# Altium project S7CAS-PLEIADES-CARTE-MERE_Pxx.PrjPcb (part 1 of 5)
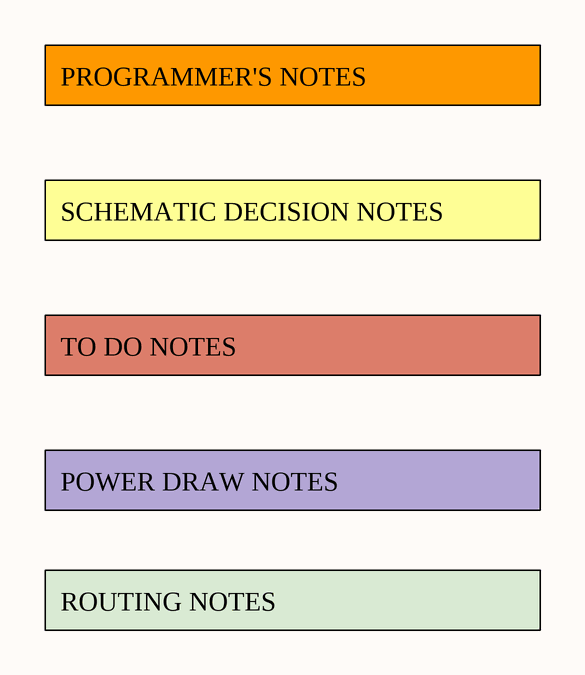
[diagram p0: S7CAS-PLEIADES-CARTE-MERE_Pxx_OVERVIEW.SchDoc]
Project_Revision: 1.00; Project_Name: PLEIADES MOTHERBOARD; Project_Group: P15; Project_Global: PLEIADES; Project_Designer2: Brahim Khalil Tekil; Project_Designer1: Julien Guay; Project_Date: 2024-01-30
18 sheets, 702 parts. Net scope: flat (ports and power ports of the same name join across sheets).
Board file: S7CAS-PLEIADES-CARTE-MERE_Pxx.PcbDoc
Sheets:
  S7CAS-PLEIADES-CARTE-MERE_Pxx_TITLE.SchDoc
  S7CAS-PLEIADES-CARTE-MERE_Pxx_OVERVIEW.SchDoc
  S7CAS-PLEIADES-CARTE-MERE_Pxx_FPGA_bank0_1_5.SchDoc
  S7CAS-PLEIADES-CARTE-MERE_Pxx_DDR.SchDoc
  S7CAS-PLEIADES-CARTE-MERE_Pxx_FPGA_bank3.SchDoc
  S7CAS-PLEIADES-CARTE-MERE_Pxx_FPGA_bank2_4.SchDoc
  S7CAS-PLEIADES-CARTE-MERE_Pxx_POWER_FPGA.SchDoc
  S7CAS-PLEIADES-CARTE-MERE_Pxx_DEBUG_USB.SchDoc
  S7CAS-PLEIADES-CARTE-MERE_Pxx_PHY.SchDoc
  S7CAS-PLEIADES-CARTE-MERE_Pxx_FLASH_PHY_CLOCK.SchDoc
  S7CAS-PLEIADES-CARTE-MERE_Pxx_CNA.SchDoc
  S7CAS-PLEIADES-CARTE-MERE_Pxx_CAN.SchDoc
  S7CAS-PLEIADES-CARTE-MERE_Pxx_MOTEUR.SchDoc
  S7CAS-PLEIADES-CARTE-MERE_Pxx_IO_SENSOR.SchDoc
  S7CAS-PLEIADES-CARTE-MERE_Pxx_ARBRE_ALIMENTATION.SchDoc
  S7CAS-PLEIADES-CARTE-MERE_Pxx_ARBRE_CAP_ARBRE.SchDoc
  S7CAS-PLEIADES-CARTE-MERE_Pxx_MECANICAL.SchDoc
  S7CAS-PLEIADES-CARTE-MERE_TO_BE_DELETED.SchDoc

## Sheet S7CAS-PLEIADES-CARTE-MERE_Pxx_TITLE.SchDoc
size Tabloid; SheetNumber: 1; SheetTotal: 3; Sheet_Name: Insert name in Document Parameters; Size: 11x17

### Notes on the sheet
- Revision history
- Package size conversion
- Metric
- 1005
- 1608
- Imperial
- 0402
- 0603
- Revision
- 2012
- 3216
- 0805
- 1206
- 3225
- 6432
- 1210
- 2512
- Date :
- Project Title
- Global Project
- Size
- Group
- Date
- Sheet
- of
- Filename
- Designers

## Sheet S7CAS-PLEIADES-CARTE-MERE_Pxx_OVERVIEW.SchDoc
size Tabloid; SheetNumber: 2; SheetTotal: 14; Sheet_Name: Insert name in Document Parameters; Size: 11x17

### Notes on the sheet
- PROGRAMMER'S NOTES
- SCHEMATIC DECISION NOTES
- TO DO NOTES
- POWER DRAW NOTES
- ROUTING NOTES
- Sheet Name
- Project Title
- Global Project
- Size
- Group
- Revision
- Date
- Sheet
- of
- Filename
- Designers

## Sheet S7CAS-PLEIADES-CARTE-MERE_Pxx_FPGA_bank0_1_5.SchDoc
size Tabloid; Date: Date; Author: Author 1; Revision: 1; SheetNumber: 3; SheetTotal: 18; Size: 11x17; Sheet_Name: BANK 0, 1 & 5
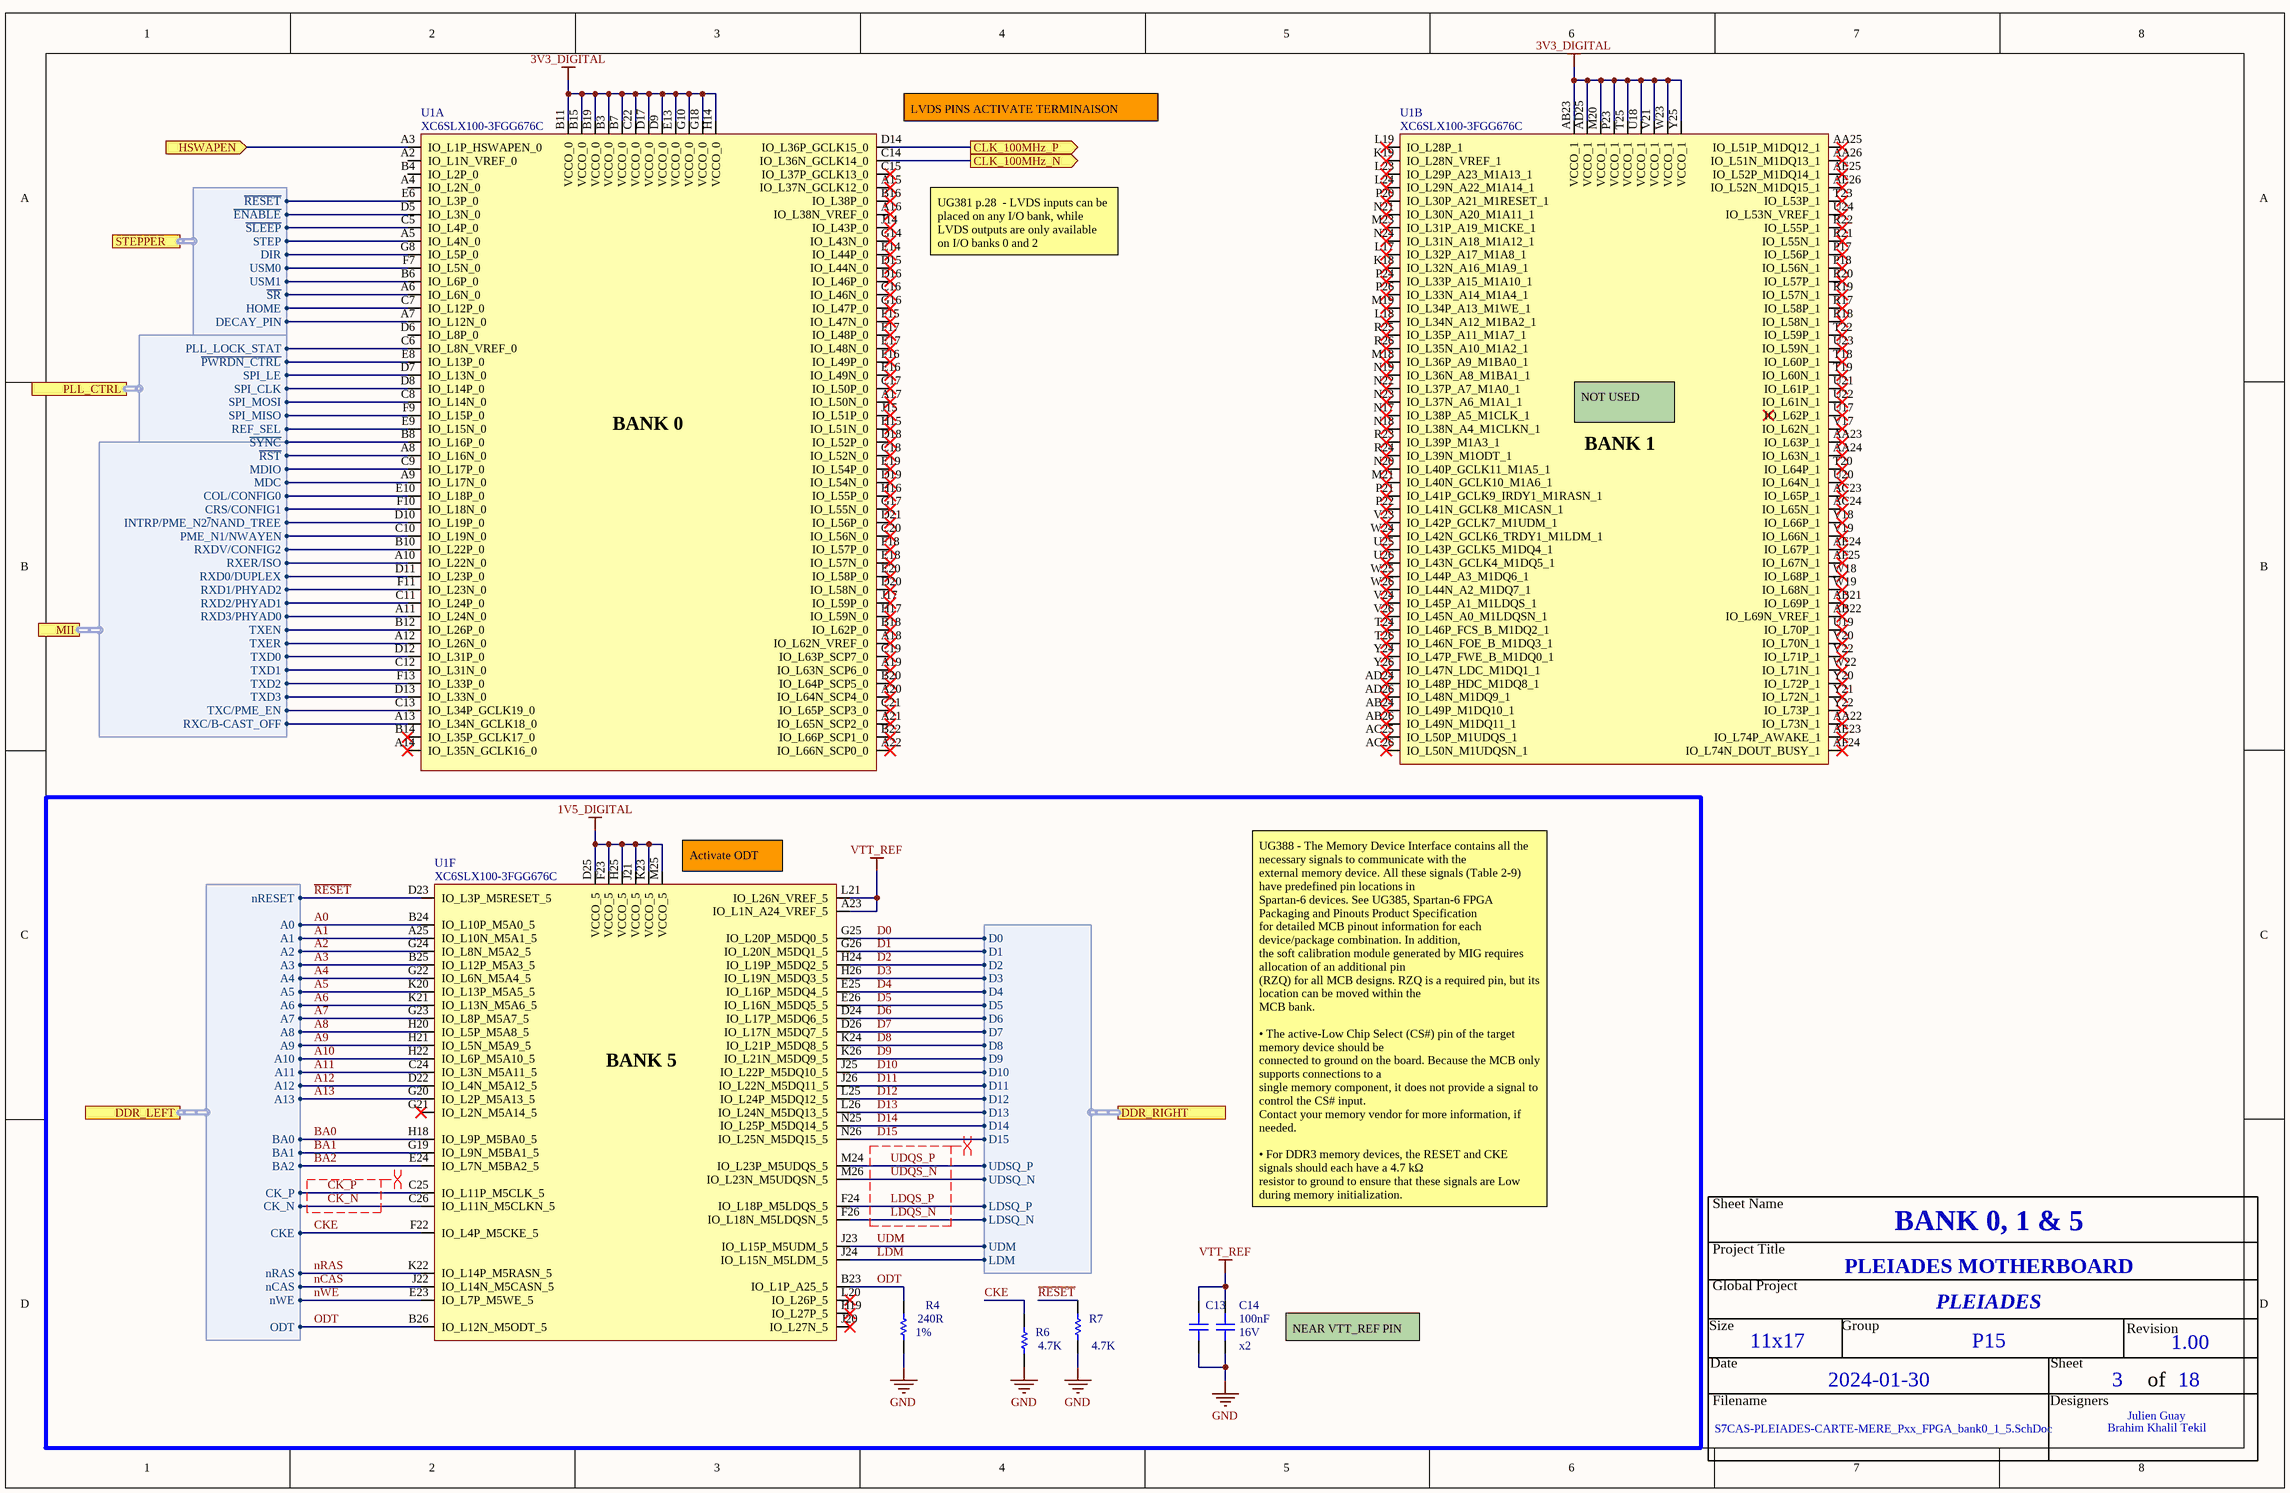
[diagram p1: S7CAS-PLEIADES-CARTE-MERE_Pxx_FPGA_bank0_1_5.SchDoc]

### Parts
C13  CAP - 0603  [CAP_0603]  (value not drawn)
C14  value 100nF  Voltage: 16V  [CAP_0603]  (hidden comment: CAP - 0603)
R4  value 240R  Precision: 1%  [RES_0603]  (hidden comment: RES - 0603)
R6  value 4.7K  [RES_0603]  (hidden comment: RES - 0603)
R7  value 4.7K  [RES_0603]  (hidden comment: RES - 0603)
U1  XC6SLX100-3FGG676C  [FPGA_XILINX_FGG676]  (parts A,B,F of 10)

### Blocks framed on the sheet
x2: C13 C14 R4 R6 R7 U1

### Ports
CLK_100MHz_N (out, see S7CAS-PLEIADES-CARTE-MERE_Pxx_FLASH_PHY_CLOCK[5A]), CLK_100MHz_P (out, see S7CAS-PLEIADES-CARTE-MERE_Pxx_FLASH_PHY_CLOCK[5A]), DDR_LEFT (harness ddr_left, see S7CAS-PLEIADES-CARTE-MERE_Pxx_DDR[1B]), DDR_RIGHT (harness ddr_right, see S7CAS-PLEIADES-CARTE-MERE_Pxx_DDR[4B]), HSWAPEN (in, see S7CAS-PLEIADES-CARTE-MERE_Pxx_FPGA_bank2_4[1D]), MII (harness MII - Harness, see S7CAS-PLEIADES-CARTE-MERE_Pxx_PHY[1C]), PLL_CTRL (harness PLL_CTRL, see S7CAS-PLEIADES-CARTE-MERE_Pxx_FLASH_PHY_CLOCK[2B]), STEPPER (harness STEPPER_MOTOR_DRIVER_HARNESS, see S7CAS-PLEIADES-CARTE-MERE_Pxx_MOTEUR[4B])

### Harnesses
ddr_left: ODT, nRAS, nCAS, nWE, CKE, CK_P, CK_N, BA0, BA1, BA2, A0, A1, A2, A3, A4, A5, A6, A7, A8, A9, A10, A11, A12, A13, nRESET
ddr_right: D0, D1, D2, D3, D4, D5, D6, D7, D8, D9, D10, D11, D12, D13, D14, D15, UDSQ_P, UDSQ_N, LDSQ_N, LDSQ_P, UDM, LDM
MII - Harness: ~{RST}, MDIO, MDC, COL/CONFIG0, CRS/CONFIG1, INTRP/PME_N2~{/}NAND_TREE, PME_N1/NWAYEN, RXDV/CONFIG2, RXER/ISO, RXD0/DUPLEX, RXD1/PHYAD2, RXD2/PHYAD1, RXD3/PHYAD0, RXC/B-CAST_OFF, TXEN, TXER, TXD0, TXD1, TXD2, TXD3, TXC/PME_EN
PLL_CTRL: ~{PWRDN_CTRL}, SPI_LE, SPI_CLK, SPI_MOSI, SPI_MISO, REF_SEL, ~{SYNC}, PLL_LOCK_STAT
STEPPER_MOTOR_DRIVER_HARNESS: ~{RESET}, ~{ENABLE}, ~{SLEEP}, STEP, DIR, USM0, USM1, ~{SR}, HOME, DECAY_PIN

### Nets
1V5_DIGITAL: U1.D25(VCCO_5) U1.F23(VCCO_5) U1.H25(VCCO_5) U1.J21(VCCO_5) U1.K23(VCCO_5) U1.M25(VCCO_5)
3V3_DIGITAL: U1.AB23(VCCO_1) U1.AD25(VCCO_1) U1.B3(VCCO_0) U1.B7(VCCO_0) U1.B11(VCCO_0) U1.B15(VCCO_0) U1.B19(VCCO_0) U1.C22(VCCO_0) U1.D9(VCCO_0) U1.D17(VCCO_0) U1.E13(VCCO_0) U1.G10(VCCO_0) U1.G18(VCCO_0) U1.H14(VCCO_0) U1.M20(VCCO_1) U1.P23(VCCO_1) U1.T25(VCCO_1) U1.U18(VCCO_1) U1.V21(VCCO_1) U1.W23(VCCO_1) U1.Y25(VCCO_1)
GND: C13.1 C14.1 R4.1 R6.1 R7.1  [project net nCS]
VTT_REF: C13.2 C14.2 U1.A23(IO_L1N_A24_VREF_5) U1.L21(IO_L26N_VREF_5)
~{RESET}: R7.2 U1.D23(IO_L3P_M5RESET_5) ; port DDR_LEFT.nRESET
A0: U1.B24(IO_L10P_M5A0_5) ; port DDR_LEFT.A0
A1: U1.A25(IO_L10N_M5A1_5) ; port DDR_LEFT.A1
A2: U1.G24(IO_L8N_M5A2_5) ; port DDR_LEFT.A2
A3: U1.B25(IO_L12P_M5A3_5) ; port DDR_LEFT.A3
A4: U1.G22(IO_L6N_M5A4_5) ; port DDR_LEFT.A4
A5: U1.K20(IO_L13P_M5A5_5) ; port DDR_LEFT.A5
A6: U1.K21(IO_L13N_M5A6_5) ; port DDR_LEFT.A6
A7: U1.G23(IO_L8P_M5A7_5) ; port DDR_LEFT.A7
A8: U1.H20(IO_L5P_M5A8_5) ; port DDR_LEFT.A8
A9: U1.H21(IO_L5N_M5A9_5) ; port DDR_LEFT.A9
A10: U1.H22(IO_L6P_M5A10_5) ; port DDR_LEFT.A10
A11: U1.C24(IO_L3N_M5A11_5) ; port DDR_LEFT.A11
A12: U1.D22(IO_L4N_M5A12_5) ; port DDR_LEFT.A12
A13: U1.G20(IO_L2P_M5A13_5) ; port DDR_LEFT.A13
BA0: U1.H18(IO_L9P_M5BA0_5) ; port DDR_LEFT.BA0
BA1: U1.G19(IO_L9N_M5BA1_5) ; port DDR_LEFT.BA1
BA2: U1.E24(IO_L7N_M5BA2_5) ; port DDR_LEFT.BA2
CK_N: U1.C26(IO_L11N_M5CLKN_5) ; port DDR_LEFT.CK_N
CK_P: U1.C25(IO_L11P_M5CLK_5) ; port DDR_LEFT.CK_P
CKE: R6.2 U1.F22(IO_L4P_M5CKE_5) ; port DDR_LEFT.CKE
CLK_100MHz_N: U1.C14(IO_L36N_GCLK14_0) ; port CLK_100MHz_N
CLK_100MHz_P: U1.D14(IO_L36P_GCLK15_0) ; port CLK_100MHz_P
COL: U1.E10(IO_L18P_0) ; port MII.COL/CONFIG0
CRS: U1.F10(IO_L18N_0) ; port MII.CRS/CONFIG1
D0: U1.G25(IO_L20P_M5DQ0_5) ; port DDR_RIGHT.D0
D1: U1.G26(IO_L20N_M5DQ1_5) ; port DDR_RIGHT.D1
D2: U1.H24(IO_L19P_M5DQ2_5) ; port DDR_RIGHT.D2
D3: U1.H26(IO_L19N_M5DQ3_5) ; port DDR_RIGHT.D3
D4: U1.E25(IO_L16P_M5DQ4_5) ; port DDR_RIGHT.D4
D5: U1.E26(IO_L16N_M5DQ5_5) ; port DDR_RIGHT.D5
D6: U1.D24(IO_L17P_M5DQ6_5) ; port DDR_RIGHT.D6
D7: U1.D26(IO_L17N_M5DQ7_5) ; port DDR_RIGHT.D7
D8: U1.K24(IO_L21P_M5DQ8_5) ; port DDR_RIGHT.D8
D9: U1.K26(IO_L21N_M5DQ9_5) ; port DDR_RIGHT.D9
D10: U1.J25(IO_L22P_M5DQ10_5) ; port DDR_RIGHT.D10
D11: U1.J26(IO_L22N_M5DQ11_5) ; port DDR_RIGHT.D11
D12: U1.L25(IO_L24P_M5DQ12_5) ; port DDR_RIGHT.D12
D13: U1.L26(IO_L24N_M5DQ13_5) ; port DDR_RIGHT.D13
D14: U1.N25(IO_L25P_M5DQ14_5) ; port DDR_RIGHT.D14
D15: U1.N26(IO_L25N_M5DQ15_5) ; port DDR_RIGHT.D15
HSWAPEN: U1.A3(IO_L1P_HSWAPEN_0) ; port HSWAPEN
INTRP: U1.D10(IO_L19P_0) ; port MII.INTRP/PME_N2~{/}NAND_TREE
LDM: U1.J24(IO_L15N_M5LDM_5) ; port DDR_RIGHT.LDM
LDQS_N: U1.F26(IO_L18N_M5LDQSN_5) ; port DDR_RIGHT.LDSQ_N
LDQS_P: U1.F24(IO_L18P_M5LDQS_5) ; port DDR_RIGHT.LDSQ_P
MDC: U1.A9(IO_L17N_0) ; port MII.MDC
MDIO: U1.C9(IO_L17P_0) ; port MII.MDIO
nCAS: U1.J22(IO_L14N_M5CASN_5) ; port DDR_LEFT.nCAS
nRAS: U1.K22(IO_L14P_M5RASN_5) ; port DDR_LEFT.nRAS
nWE: U1.E23(IO_L7P_M5WE_5) ; port DDR_LEFT.nWE
ODT: R4.2 U1.B23(IO_L1P_A25_5) U1.B26(IO_L12N_M5ODT_5) ; port DDR_LEFT.ODT
PME_N1/NWAYEN: U1.C10(IO_L19N_0) ; port MII.PME_N1/NWAYEN
RXC: U1.A13(IO_L34N_GCLK18_0) ; port MII.RXC/B-CAST_OFF
RXD0: U1.D11(IO_L23P_0) ; port MII.RXD0/DUPLEX
RXD1: U1.F11(IO_L23N_0) ; port MII.RXD1/PHYAD2
RXD2: U1.C11(IO_L24P_0) ; port MII.RXD2/PHYAD1
RXD3: U1.A11(IO_L24N_0) ; port MII.RXD3/PHYAD0
RXDV: U1.B10(IO_L22P_0) ; port MII.RXDV/CONFIG2
RXER: U1.A10(IO_L22N_0) ; port MII.RXER/ISO
TXC: U1.C13(IO_L34P_GCLK19_0) ; port MII.TXC/PME_EN
TXD0: U1.D12(IO_L31P_0) ; port MII.TXD0
TXD1: U1.C12(IO_L31N_0) ; port MII.TXD1
TXD2: U1.F13(IO_L33P_0) ; port MII.TXD2
TXD3: U1.D13(IO_L33N_0) ; port MII.TXD3
TXEN: U1.B12(IO_L26P_0) ; port MII.TXEN
TXER: U1.A12(IO_L26N_0) ; port MII.TXER
UDM: U1.J23(IO_L15P_M5UDM_5) ; port DDR_RIGHT.UDM
UDQS_N: U1.M26(IO_L23N_M5UDQSN_5) ; port DDR_RIGHT.UDSQ_N
UDQS_P: U1.M24(IO_L23P_M5UDQS_5) ; port DDR_RIGHT.UDSQ_P
USM0: U1.F7(IO_L5N_0) ; port STEPPER.USM0
USM1: U1.B6(IO_L6P_0) ; port STEPPER.USM1
NetR37_1: U1.D7(IO_L13N_0) ; port PLL_CTRL.SPI_LE
NetR75_1: U1.A8(IO_L16N_0) ; port MII.~{RST}
NetR117_2: U1.A7(IO_L12N_0) ; port STEPPER.DECAY_PIN
NetU1_A5: U1.A5(IO_L4N_0) ; port STEPPER.STEP
NetU1_A6: U1.A6(IO_L6N_0) ; port STEPPER.~{SR}
NetU1_B8: U1.B8(IO_L16P_0) ; port PLL_CTRL.~{SYNC}
NetU1_C5: U1.C5(IO_L4P_0) ; port STEPPER.~{SLEEP}
NetU1_C6: U1.C6(IO_L8N_VREF_0) ; port PLL_CTRL.PLL_LOCK_STAT
NetU1_C7: U1.C7(IO_L12P_0) ; port STEPPER.HOME
NetU1_C8: U1.C8(IO_L14N_0) ; port PLL_CTRL.SPI_MOSI
NetU1_D5: U1.D5(IO_L3N_0) ; port STEPPER.~{ENABLE}
NetU1_D8: U1.D8(IO_L14P_0) ; port PLL_CTRL.SPI_CLK
NetU1_E6: U1.E6(IO_L3P_0) ; port STEPPER.~{RESET}
NetU1_E8: U1.E8(IO_L13P_0) ; port PLL_CTRL.~{PWRDN_CTRL}
NetU1_E9: U1.E9(IO_L15N_0) ; port PLL_CTRL.REF_SEL
NetU1_F9: U1.F9(IO_L15P_0) ; port PLL_CTRL.SPI_MISO
NetU1_G8: U1.G8(IO_L5P_0) ; port STEPPER.DIR

Not connected (* = marked no-connect by the designer): U1 A2(IO_L1N_VREF_0) A4(IO_L2N_0) A14(IO_L35N_GCLK16_0)* A15(IO_L37N_GCLK12_0)* A16(IO_L38N_VREF_0)* A17(IO_L50N_0)* A18(IO_L62N_VREF_0)* A19(IO_L63N_SCP6_0)* A20(IO_L64N_SCP4_0)* A21(IO_L65N_SCP2_0)* A22(IO_L66N_SCP0_0)* AA22(IO_L73N_1)* AA23(IO_L63P_1)* AA24(IO_L63N_1)* AA25(IO_L51P_M1DQ12_1)* AA26(IO_L51N_M1DQ13_1)* AB21(IO_L69P_1)* AB22(IO_L69N_VREF_1)* AB24(IO_L49P_M1DQ10_1)* AB26(IO_L49N_M1DQ11_1)* AC23(IO_L65P_1)* AC24(IO_L65N_1)* AC25(IO_L50P_M1UDQS_1)* AC26(IO_L50N_M1UDQSN_1)* AD24(IO_L48P_HDC_M1DQ8_1)* AD26(IO_L48N_M1DQ9_1)* AE23(IO_L74P_AWAKE_1)* AE24(IO_L67P_1)* AE25(IO_L52P_M1DQ14_1)* AE26(IO_L52N_M1DQ15_1)* AF24(IO_L74N_DOUT_BUSY_1)* AF25(IO_L67N_1)* B4(IO_L2P_0) B14(IO_L35P_GCLK17_0)* B16(IO_L38P_0)* B18(IO_L62P_0)* B20(IO_L64P_SCP5_0)* B22(IO_L66P_SCP1_0)* C15(IO_L37P_GCLK13_0)* C16(IO_L46N_0)* C17(IO_L50P_0)* C18(IO_L52N_0)* C19(IO_L63P_SCP7_0)* C20(IO_L56N_0)* C21(IO_L65P_SCP3_0)* D6(IO_L8P_0) D15(IO_L44N_0)* D16(IO_L46P_0)* D18(IO_L52P_0)* D19(IO_L54N_0)* D20(IO_L58N_0)* D21(IO_L56P_0)* E14(IO_L44P_0)* E16(IO_L49N_0)* E17(IO_L48N_0)* E18(IO_L57N_0)* E19(IO_L54P_0)* E20(IO_L58P_0)* F15(IO_L47N_0)* F16(IO_L49P_0)* F17(IO_L48P_0)* F18(IO_L57P_0)* G14(IO_L43N_0)* G16(IO_L47P_0)* G17(IO_L55N_0)* G21(IO_L2N_M5A14_5)* H15(IO_L51N_0)* H16(IO_L55P_0)* H17(IO_L59N_0)* H19(IO_L27P_5)* J14(IO_L43P_0)* J15(IO_L51P_0)* J17(IO_L59P_0)* J20(IO_L27N_5)* K18(IO_L32N_A16_M1A9_1)* K19(IO_L28N_VREF_1)* L17(IO_L32P_A17_M1A8_1)* L18(IO_L34N_A12_M1BA2_1)* L19(IO_L28P_1)* L20(IO_L26P_5)* L23(IO_L29P_A23_M1A13_1)* L24(IO_L29N_A22_M1A14_1)* M18(IO_L36P_A9_M1BA0_1)* M19(IO_L34P_A13_M1WE_1)* M21(IO_L40N_GCLK10_M1A6_1)* M23(IO_L31P_A19_M1CKE_1)* N17(IO_L38P_A5_M1CLK_1)* N18(IO_L38N_A4_M1CLKN_1)* N19(IO_L36N_A8_M1BA1_1)* N20(IO_L40P_GCLK11_M1A5_1)* N21(IO_L30N_A20_M1A11_1)* N22(IO_L37P_A7_M1A0_1)* N23(IO_L37N_A6_M1A1_1)* N24(IO_L31N_A18_M1A12_1)* P17(IO_L56P_1)* P18(IO_L56N_1)* P20(IO_L30P_A21_M1RESET_1)* P21(IO_L41P_GCLK9_IRDY1_M1RASN_1)* P22(IO_L41N_GCLK8_M1CASN_1)* P24(IO_L33P_A15_M1A10_1)* P26(IO_L33N_A14_M1A4_1)* R17(IO_L58P_1)* R18(IO_L58N_1)* R19(IO_L57N_1)* R20(IO_L57P_1)* R21(IO_L55N_1)* R22(IO_L55P_1)* R23(IO_L39P_M1A3_1)* R24(IO_L39N_M1ODT_1)* R25(IO_L35P_A11_M1A7_1)* R26(IO_L35N_A10_M1A2_1)* T18(IO_L60P_1)* T19(IO_L60N_1)* T20(IO_L64P_1)* T22(IO_L59P_1)* T23(IO_L53P_1)* T24(IO_L46P_FCS_B_M1DQ2_1)* T26(IO_L46N_FOE_B_M1DQ3_1)* U17(IO_L62P_1)* U19(IO_L70P_1)* U20(IO_L64N_1)* U21(IO_L61P_1)* U22(IO_L61N_1)* U23(IO_L59N_1)* U24(IO_L53N_VREF_1)* U25(IO_L43P_GCLK5_M1DQ4_1)* U26(IO_L43N_GCLK4_M1DQ5_1)* V17(IO_L62N_1)* V18(IO_L66P_1)* V19(IO_L66N_1)* V20(IO_L70N_1)* V22(IO_L71P_1)* V23(IO_L42P_GCLK7_M1UDM_1)* V24(IO_L45P_A1_M1LDQS_1)* V26(IO_L45N_A0_M1LDQSN_1)* W18(IO_L68P_1)* W19(IO_L68N_1)* W22(IO_L71N_1)* W24(IO_L42N_GCLK6_TRDY1_M1LDM_1)* W25(IO_L44P_A3_M1DQ6_1)* W26(IO_L44N_A2_M1DQ7_1)* Y20(IO_L72P_1)* Y21(IO_L72N_1)* Y22(IO_L73P_1)* Y24(IO_L47P_FWE_B_M1DQ0_1)* Y26(IO_L47N_LDC_M1DQ1_1)*

### Layout directives
differential pair; differential pair class DDR_CK_PAIR: CK_N, CK_P
differential pair; differential pair class DQS_DIFF_PAIR: LDQS_N, LDQS_P, UDQS_N, UDQS_P

### Notes on the sheet
- (near U1) LVDS PINS ACTIVATE TERMINAISON
- UG381 p.28  - LVDS inputs can be placed on any I/O bank, while
  LVDS outputs are only available on I/O banks 0 and 2
- (near U1) NOT USED
- (near U1) Activate ODT
- UG388 - The Memory Device Interface contains all the necessary signals to communicate with the
  external memory device. All these signals (Table 2-9) have predefined pin locations in
  Spartan-6 devices. See UG385, Spartan-6 FPGA Packaging and Pinouts Product Specification
  for detailed MCB pinout information for each device/package combination. In addition,
  the soft calibration module generated by MIG requires allocation of an additional pin
  (RZQ) for all MCB designs. RZQ is a required pin, but its location can be moved within the
  MCB bank.
  • The active-Low Chip Select (CS#) pin of the target memory device should be
  connected to ground on the board. Because the MCB only supports connections to a
  single memory component, it does not provide a signal to control the CS# input.
  Contact your memory vendor for more information, if needed.
  • For DDR3 memory devices, the RESET and CKE signals should each have a 4.7 kΩ
  resistor to ground to ensure that these signals are Low during memory initialization.
- NEAR VTT_REF PIN
- Sheet Name
- Project Title
- Global Project
- Revision
- Size
- Date
- Group
- Sheet
- of
- Filename
- Designers
- (in symbol FPGA_XC6SLX100-3FGG676C, part A) BANK 0
- (in symbol FPGA_XC6SLX100-3FGG676C, part B) BANK 1
- (in symbol FPGA_XC6SLX100-3FGG676C, part F) BANK 5

### Library data of the parts
C13 = CAP - 0603: Precision: 10%; Voltage: 16V; Value: 100nF; Current: *; CreatedBy: Jonathan Bouchard; Power: *; Package: 0603; Supplier 1: Arrow Electronics; Supplier Part Number 1: CL10B104KO8NNNC
C14 = CAP - 0603: Precision: 10%; Current: *; CreatedBy: Jonathan Bouchard; Power: *; Package: 0603; Supplier 1: Arrow Electronics; Supplier Part Number 1: CL10B104KO8NNNC
R6 R7 = RES - 0603: Precision: 1%; Current: *; CreatedBy: Jonathan Bouchard; Package: 0603; Supplier 1: Arrow Electronics; Supplier Part Number 1: RMCF0603FT4K70
U1 = FPGA_XC6SLX100-3FGG676C: FPGA - XILINX SPARTAN 6 480 I/O - BGA-676; Voltage: 1.14 V ~ 1.26 V; Current: *; Power: *; Mfg: Xilinx; Mfg Part Number: XC6SLX100-3FGG676C; HelpURL: https://www.xilinx.com/support/documentation/data_sheets/ds162.pdf; CreatedBy: Jonathan Bouchard; Temperature: 0°C ~ 85°C (TJ); Value: *; Precision: *; Package: BGA-676; Supplier 1: Digikey; Supplier Part Number 1: 122-1760-ND
R4 = RES - 0603: Current: *; CreatedBy: Jonathan Bouchard; Package: 0603; Supplier 1: Arrow Electronics; Supplier Part Number 1: RMCF0603FT240R

## Sheet S7CAS-PLEIADES-CARTE-MERE_Pxx_DDR.SchDoc
size Tabloid; SheetNumber: 4; SheetTotal: 17; Sheet_Name: DDR; Size: 11x17
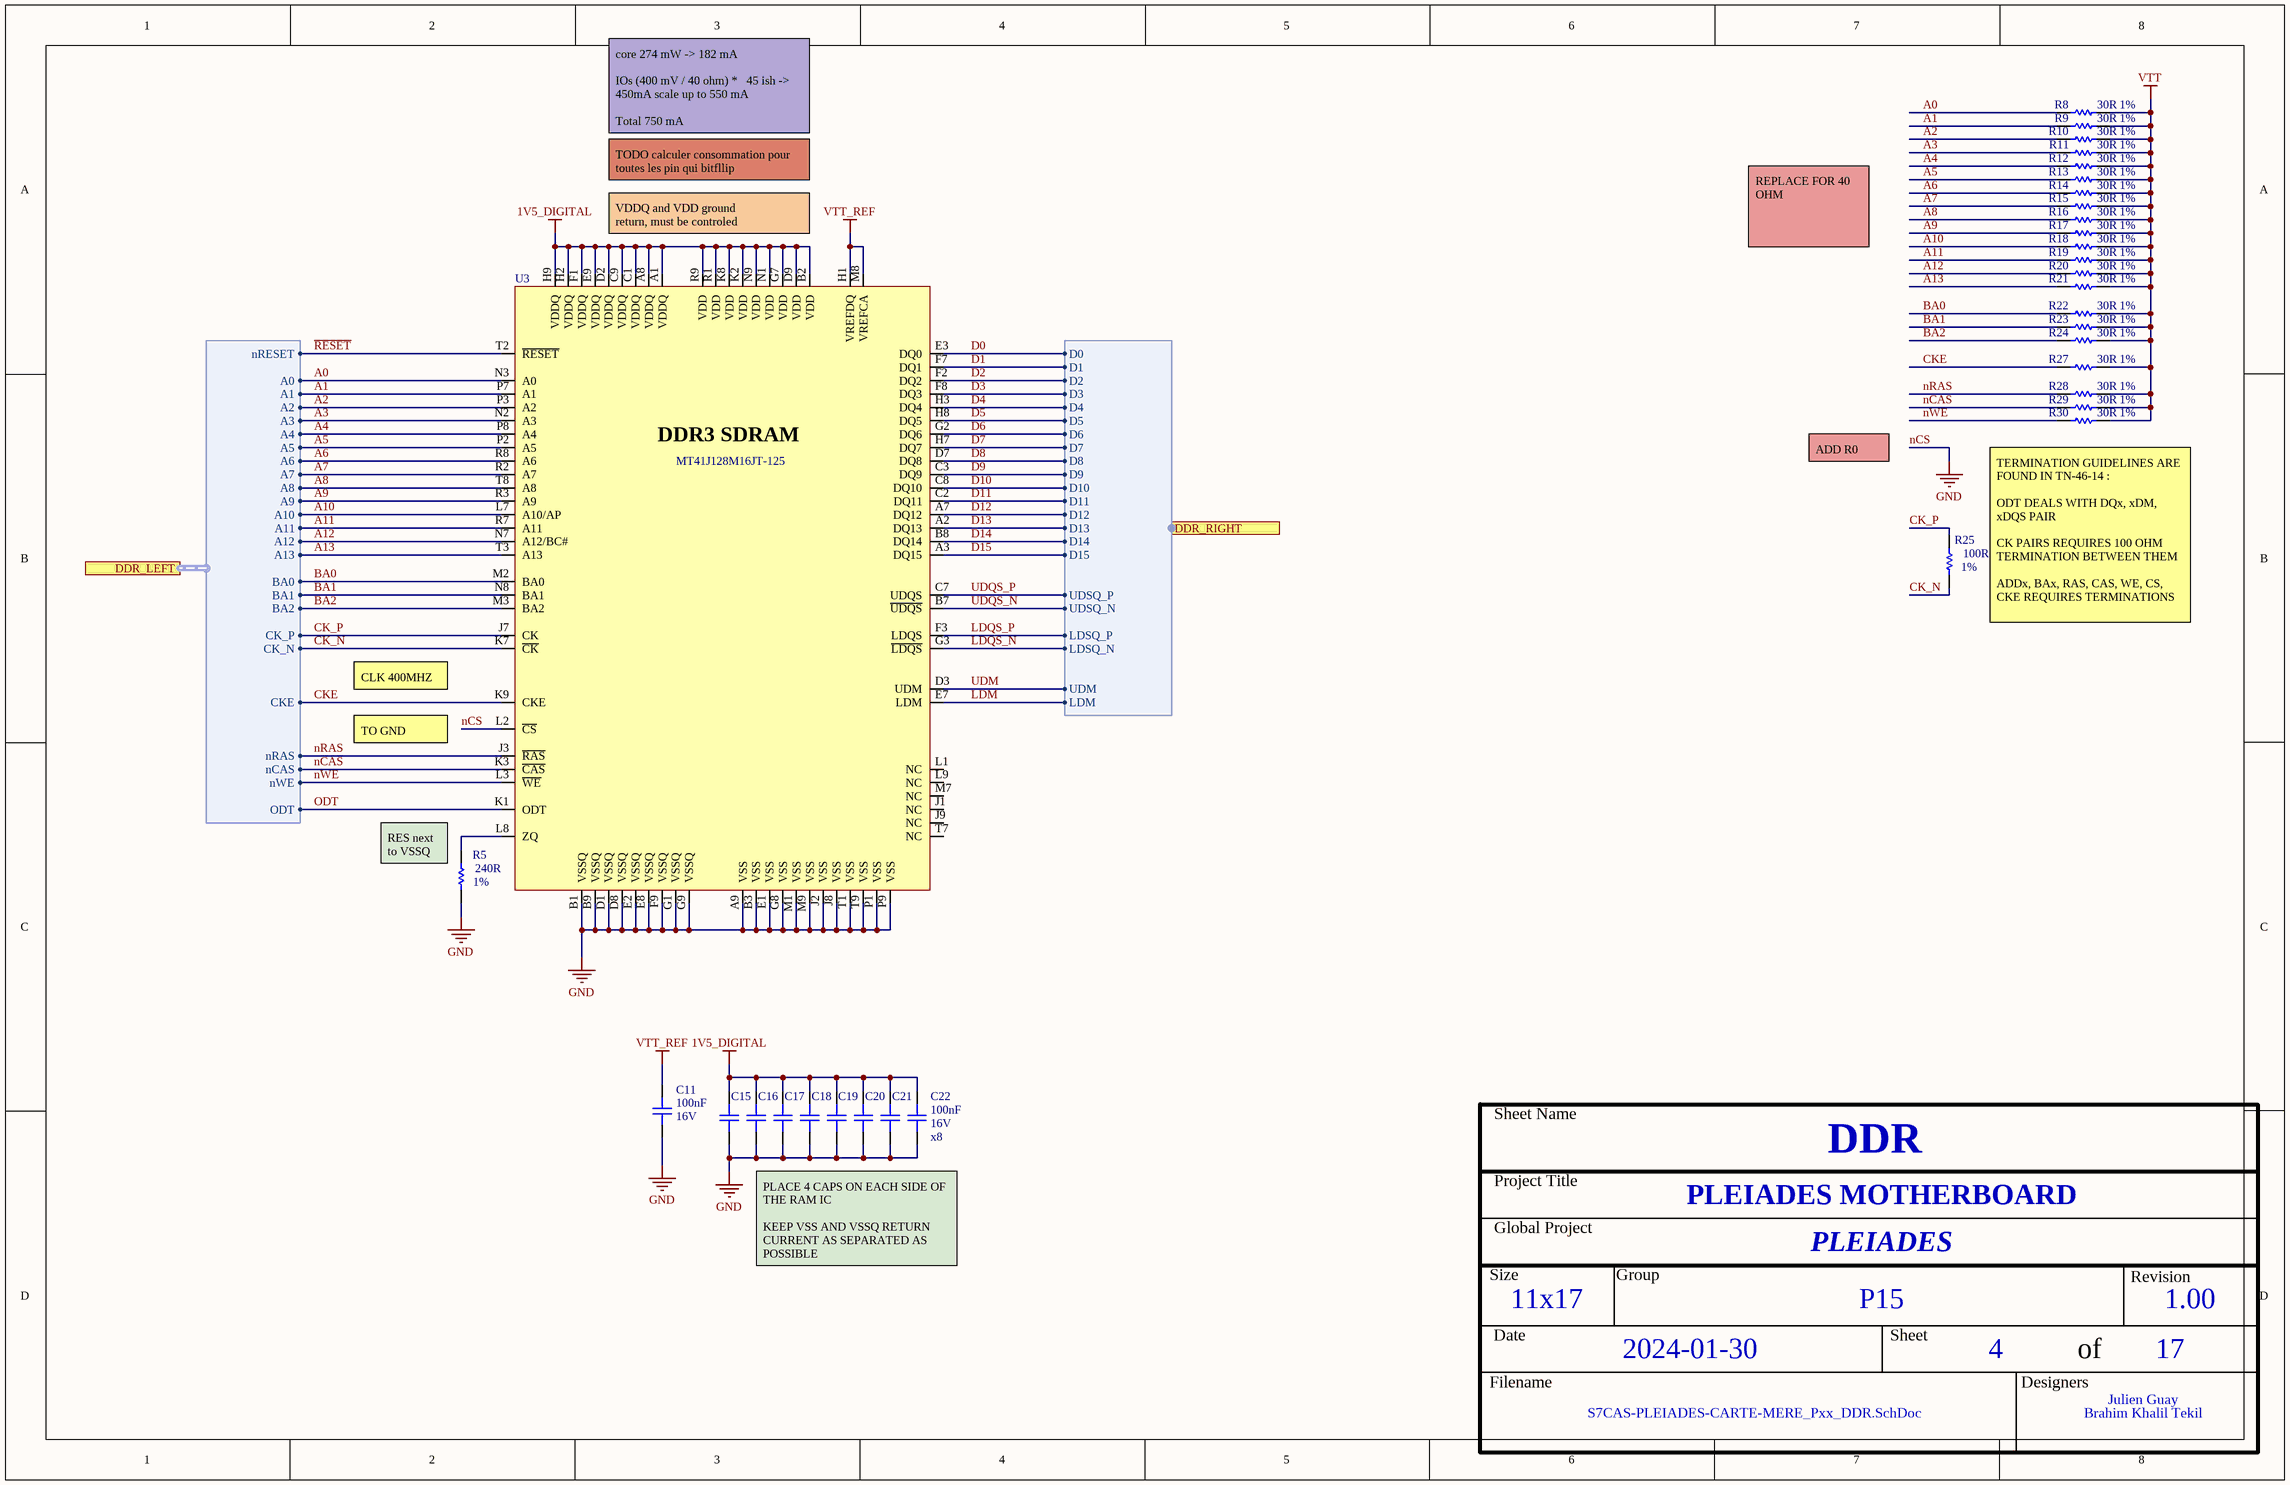
[diagram p2: S7CAS-PLEIADES-CARTE-MERE_Pxx_DDR.SchDoc]

### Parts
C11  value 100nF  Voltage: 16V  [CAP_0603]  (hidden comment: CAP - 0603)
C15  CAP - 0603  [CAP_0603]  (value not drawn)
C16  CAP - 0603  [CAP_0603]  (value not drawn)
C17  CAP - 0603  [CAP_0603]  (value not drawn)
C18  CAP - 0603  [CAP_0603]  (value not drawn)
C19  CAP - 0603  [CAP_0603]  (value not drawn)
C20  CAP - 0603  [CAP_0603]  (value not drawn)
C21  CAP - 0603  [CAP_0603]  (value not drawn)
C22  value 100nF  Voltage: 16V  [CAP_0603]  (hidden comment: CAP - 0603)
R5  value 240R  Precision: 1%  [RES_0603]  (hidden comment: RES - 0603)
R8  value 30R  Precision: 1%  [RES_0603]  (hidden comment: RES - 0603)
R9  value 30R  Precision: 1%  [RES_0603]  (hidden comment: RES - 0603)
R10  value 30R  Precision: 1%  [RES_0603]  (hidden comment: RES - 0603)
R11  value 30R  Precision: 1%  [RES_0603]  (hidden comment: RES - 0603)
R12  value 30R  Precision: 1%  [RES_0603]  (hidden comment: RES - 0603)
R13  value 30R  Precision: 1%  [RES_0603]  (hidden comment: RES - 0603)
R14  value 30R  Precision: 1%  [RES_0603]  (hidden comment: RES - 0603)
R15  value 30R  Precision: 1%  [RES_0603]  (hidden comment: RES - 0603)
R16  value 30R  Precision: 1%  [RES_0603]  (hidden comment: RES - 0603)
R17  value 30R  Precision: 1%  [RES_0603]  (hidden comment: RES - 0603)
R18  value 30R  Precision: 1%  [RES_0603]  (hidden comment: RES - 0603)
R19  value 30R  Precision: 1%  [RES_0603]  (hidden comment: RES - 0603)
R20  value 30R  Precision: 1%  [RES_0603]  (hidden comment: RES - 0603)
R21  value 30R  Precision: 1%  [RES_0603]  (hidden comment: RES - 0603)
R22  value 30R  Precision: 1%  [RES_0603]  (hidden comment: RES - 0603)
R23  value 30R  Precision: 1%  [RES_0603]  (hidden comment: RES - 0603)
R24  value 30R  Precision: 1%  [RES_0603]  (hidden comment: RES - 0603)
R25  value 100R  Precision: 1%  [RES_0603]  (hidden comment: RES - 0603)
R27  value 30R  Precision: 1%  [RES_0603]  (hidden comment: RES - 0603)
R28  value 30R  Precision: 1%  [RES_0603]  (hidden comment: RES - 0603)
R29  value 30R  Precision: 1%  [RES_0603]  (hidden comment: RES - 0603)
R30  value 30R  Precision: 1%  [RES_0603]  (hidden comment: RES - 0603)
U3  MT41J128M16JT-125  [MEM_DDR3_MT41J128M16JT-125]

### Ports
DDR_LEFT (harness ddr_left, see S7CAS-PLEIADES-CARTE-MERE_Pxx_FPGA_bank0_1_5[1C]), DDR_RIGHT (harness ddr_right, see S7CAS-PLEIADES-CARTE-MERE_Pxx_FPGA_bank0_1_5[3C])

### Harnesses
ddr_left: ODT, nRAS, nCAS, nWE, CKE, CK_P, CK_N, BA0, BA1, BA2, A0, A1, A2, A3, A4, A5, A6, A7, A8, A9, A10, A11, A12, A13, nRESET
ddr_right: D0, D1, D2, D3, D4, D5, D6, D7, D8, D9, D10, D11, D12, D13, D14, D15, UDSQ_P, UDSQ_N, LDSQ_N, LDSQ_P, UDM, LDM

### Nets
1V5_DIGITAL: C15.2 C16.2 C17.2 C18.2 C19.2 C20.2 C21.2 C22.2 U3.A1(VDDQ) U3.A8(VDDQ) U3.B2(VDD) U3.C1(VDDQ) U3.C9(VDDQ) U3.D2(VDDQ) U3.D9(VDD) U3.E9(VDDQ) U3.F1(VDDQ) U3.G7(VDD) U3.H2(VDDQ) U3.H9(VDDQ) U3.K2(VDD) U3.K8(VDD) U3.N1(VDD) U3.N9(VDD) U3.R1(VDD) U3.R9(VDD)
nCS: C11.1 C15.1 C16.1 C17.1 C18.1 C19.1 C20.1 C21.1 C22.1 R5.1 U3.A9(VSS) U3.B1(VSSQ) U3.B3(VSS) U3.B9(VSSQ) U3.D1(VSSQ) U3.D8(VSSQ) U3.E1(VSS) U3.E2(VSSQ) U3.E8(VSSQ) U3.F9(VSSQ) U3.G1(VSSQ) U3.G8(VSS) U3.G9(VSSQ) U3.J2(VSS) U3.J8(VSS) U3.L2(~{CS}) U3.M1(VSS) U3.M9(VSS) U3.P1(VSS) U3.P9(VSS) U3.T1(VSS) U3.T9(VSS)  [also labelled GND]
VTT: R8.1 R9.1 R10.1 R11.1 R12.1 R13.1 R14.1 R15.1 R16.1 R17.1 R18.1 R19.1 R20.1 R21.1 R22.1 R23.1 R24.1 R27.1 R28.1 R29.1 R30.1
VTT_REF: C11.2 U3.H1(VREFDQ) U3.M8(VREFCA)
~{RESET}: U3.T2(~{RESET}) ; port DDR_LEFT.nRESET
A0: R8.2 U3.N3(A0) ; port DDR_LEFT.A0
A1: R9.2 U3.P7(A1) ; port DDR_LEFT.A1
A2: R10.2 U3.P3(A2) ; port DDR_LEFT.A2
A3: R11.2 U3.N2(A3) ; port DDR_LEFT.A3
A4: R12.2 U3.P8(A4) ; port DDR_LEFT.A4
A5: R13.2 U3.P2(A5) ; port DDR_LEFT.A5
A6: R14.2 U3.R8(A6) ; port DDR_LEFT.A6
A7: R15.2 U3.R2(A7) ; port DDR_LEFT.A7
A8: R16.2 U3.T8(A8) ; port DDR_LEFT.A8
A9: R17.2 U3.R3(A9) ; port DDR_LEFT.A9
A10: R18.2 U3.L7(A10/AP) ; port DDR_LEFT.A10
A11: R19.2 U3.R7(A11) ; port DDR_LEFT.A11
A12: R20.2 U3.N7(A12/BC#) ; port DDR_LEFT.A12
A13: R21.2 U3.T3(A13) ; port DDR_LEFT.A13
BA0: R22.2 U3.M2(BA0) ; port DDR_LEFT.BA0
BA1: R23.2 U3.N8(BA1) ; port DDR_LEFT.BA1
BA2: R24.2 U3.M3(BA2) ; port DDR_LEFT.BA2
CK_N: R25.1 U3.K7(~{CK}) ; port DDR_LEFT.CK_N
CK_P: R25.2 U3.J7(CK) ; port DDR_LEFT.CK_P
CKE: R27.2 U3.K9(CKE) ; port DDR_LEFT.CKE
D0: U3.E3(DQ0) ; port DDR_RIGHT.D0
D1: U3.F7(DQ1) ; port DDR_RIGHT.D1
D2: U3.F2(DQ2) ; port DDR_RIGHT.D2
D3: U3.F8(DQ3) ; port DDR_RIGHT.D3
D4: U3.H3(DQ4) ; port DDR_RIGHT.D4
D5: U3.H8(DQ5) ; port DDR_RIGHT.D5
D6: U3.G2(DQ6) ; port DDR_RIGHT.D6
D7: U3.H7(DQ7) ; port DDR_RIGHT.D7
D8: U3.D7(DQ8) ; port DDR_RIGHT.D8
D9: U3.C3(DQ9) ; port DDR_RIGHT.D9
D10: U3.C8(DQ10) ; port DDR_RIGHT.D10
D11: U3.C2(DQ11) ; port DDR_RIGHT.D11
D12: U3.A7(DQ12) ; port DDR_RIGHT.D12
D13: U3.A2(DQ13) ; port DDR_RIGHT.D13
D14: U3.B8(DQ14) ; port DDR_RIGHT.D14
D15: U3.A3(DQ15) ; port DDR_RIGHT.D15
LDM: U3.E7(LDM) ; port DDR_RIGHT.LDM
LDQS_N: U3.G3(~{LDQS}) ; port DDR_RIGHT.LDSQ_N
LDQS_P: U3.F3(LDQS) ; port DDR_RIGHT.LDSQ_P
nCAS: R29.2 U3.K3(~{CAS}) ; port DDR_LEFT.nCAS
nRAS: R28.2 U3.J3(~{RAS}) ; port DDR_LEFT.nRAS
nWE: R30.2 U3.L3(~{WE}) ; port DDR_LEFT.nWE
ODT: U3.K1(ODT) ; port DDR_LEFT.ODT
UDM: U3.D3(UDM) ; port DDR_RIGHT.UDM
UDQS_N: U3.B7(~{UDQS}) ; port DDR_RIGHT.UDSQ_N
UDQS_P: U3.C7(UDQS) ; port DDR_RIGHT.UDSQ_P
NetR5_2: R5.2 U3.L8(ZQ)

Not connected (* = marked no-connect by the designer): U3 J1(NC) J9(NC) L1(NC) L9(NC) M7(NC) T7(NC)

### Notes on the sheet
- core 274 mW -> 182 mA
  IOs (400 mV / 40 ohm) *   45 ish -> 450mA scale up to 550 mA
  Total 750 mA
- VDDQ and VDD ground
  return, must be controled
- TODO calculer consommation pour toutes les pin qui bitfllip
- REPLACE FOR 40 OHM
- ADD R0
- TERMINATION GUIDELINES ARE FOUND IN TN-46-14 :
  ODT DEALS WITH DQx, xDM, xDQS PAIR
  CK PAIRS REQUIRES 100 OHM TERMINATION BETWEEN THEM
  ADDx, BAx, RAS, CAS, WE, CS, CKE REQUIRES TERMINATIONS
- CLK 400MHZ
- TO GND
- (near R5) RES next to VSSQ
- (near C22) x8
- PLACE 4 CAPS ON EACH SIDE OF THE RAM IC
  KEEP VSS AND VSSQ RETURN CURRENT AS SEPARATED AS POSSIBLE
- Sheet Name
- Project Title
- Global Project
- Size
- Group
- Revision
- Date
- Sheet
- of
- Filename
- Designers
- (in symbol MEM_DDR3_MT41J128M16JT-125:K TR) DDR3 SDRAM

### Library data of the parts
C11 C22 = CAP - 0603: Precision: 10%; Current: *; CreatedBy: Jonathan Bouchard; Power: *; Package: 0603; Supplier 1: Arrow Electronics; Supplier Part Number 1: CL10B104KO8NNNC
C15-C21 = CAP - 0603: as C13 on sheet S7CAS-PLEIADES-CARTE-MERE_Pxx_FPGA_bank0_1_5; Current: *; CreatedBy: Jonathan Bouchard; Power: *; Package: 0603; Supplier 1: Arrow Electronics; Supplier Part Number 1: CL10B104KO8NNNC
U3 = MEM_DDR3_MT41J128M16JT-125:K TR: MEM - DDR3 SDRAM 2GBIT 800MHZ - TFBGA-96; Voltage: 1.425 V ~ 1.575 V; Mfg: Micrel; Current: *; Power: *; Mfg Part Number: MT41J128M16JT-125; HelpURL: http://www.micron.com/~/media/Documents/Products/Data%20Sheet/DRAM/DDR3/2Gb_DDR3_SDRAM.pdf; CreatedBy: Jonathan Bouchard; Temperature: 0°C ~ 95°C (TC); Value: *; Precision: *; Package: TFBGA-96; Supplier 1: Digikey; Supplier Part Number 1: 557-1611-1-ND
R5 R8-R25 R27-R30 = RES - 0603: Current: *; CreatedBy: Jonathan Bouchard; Package: 0603; Supplier 1: Arrow Electronics
  R5: Supplier Part Number 1: RMCF0603FT240R
  R8-R24 R27-R30: Supplier Part Number 1: RMCF0603FT30R0
  R25: Supplier Part Number 1: RMCF0603FT100R

## Sheet S7CAS-PLEIADES-CARTE-MERE_Pxx_FPGA_bank3.SchDoc
size Tabloid; SheetNumber: 5; SheetTotal: 18; Size: 11x17; Sheet_Name: BANK 3
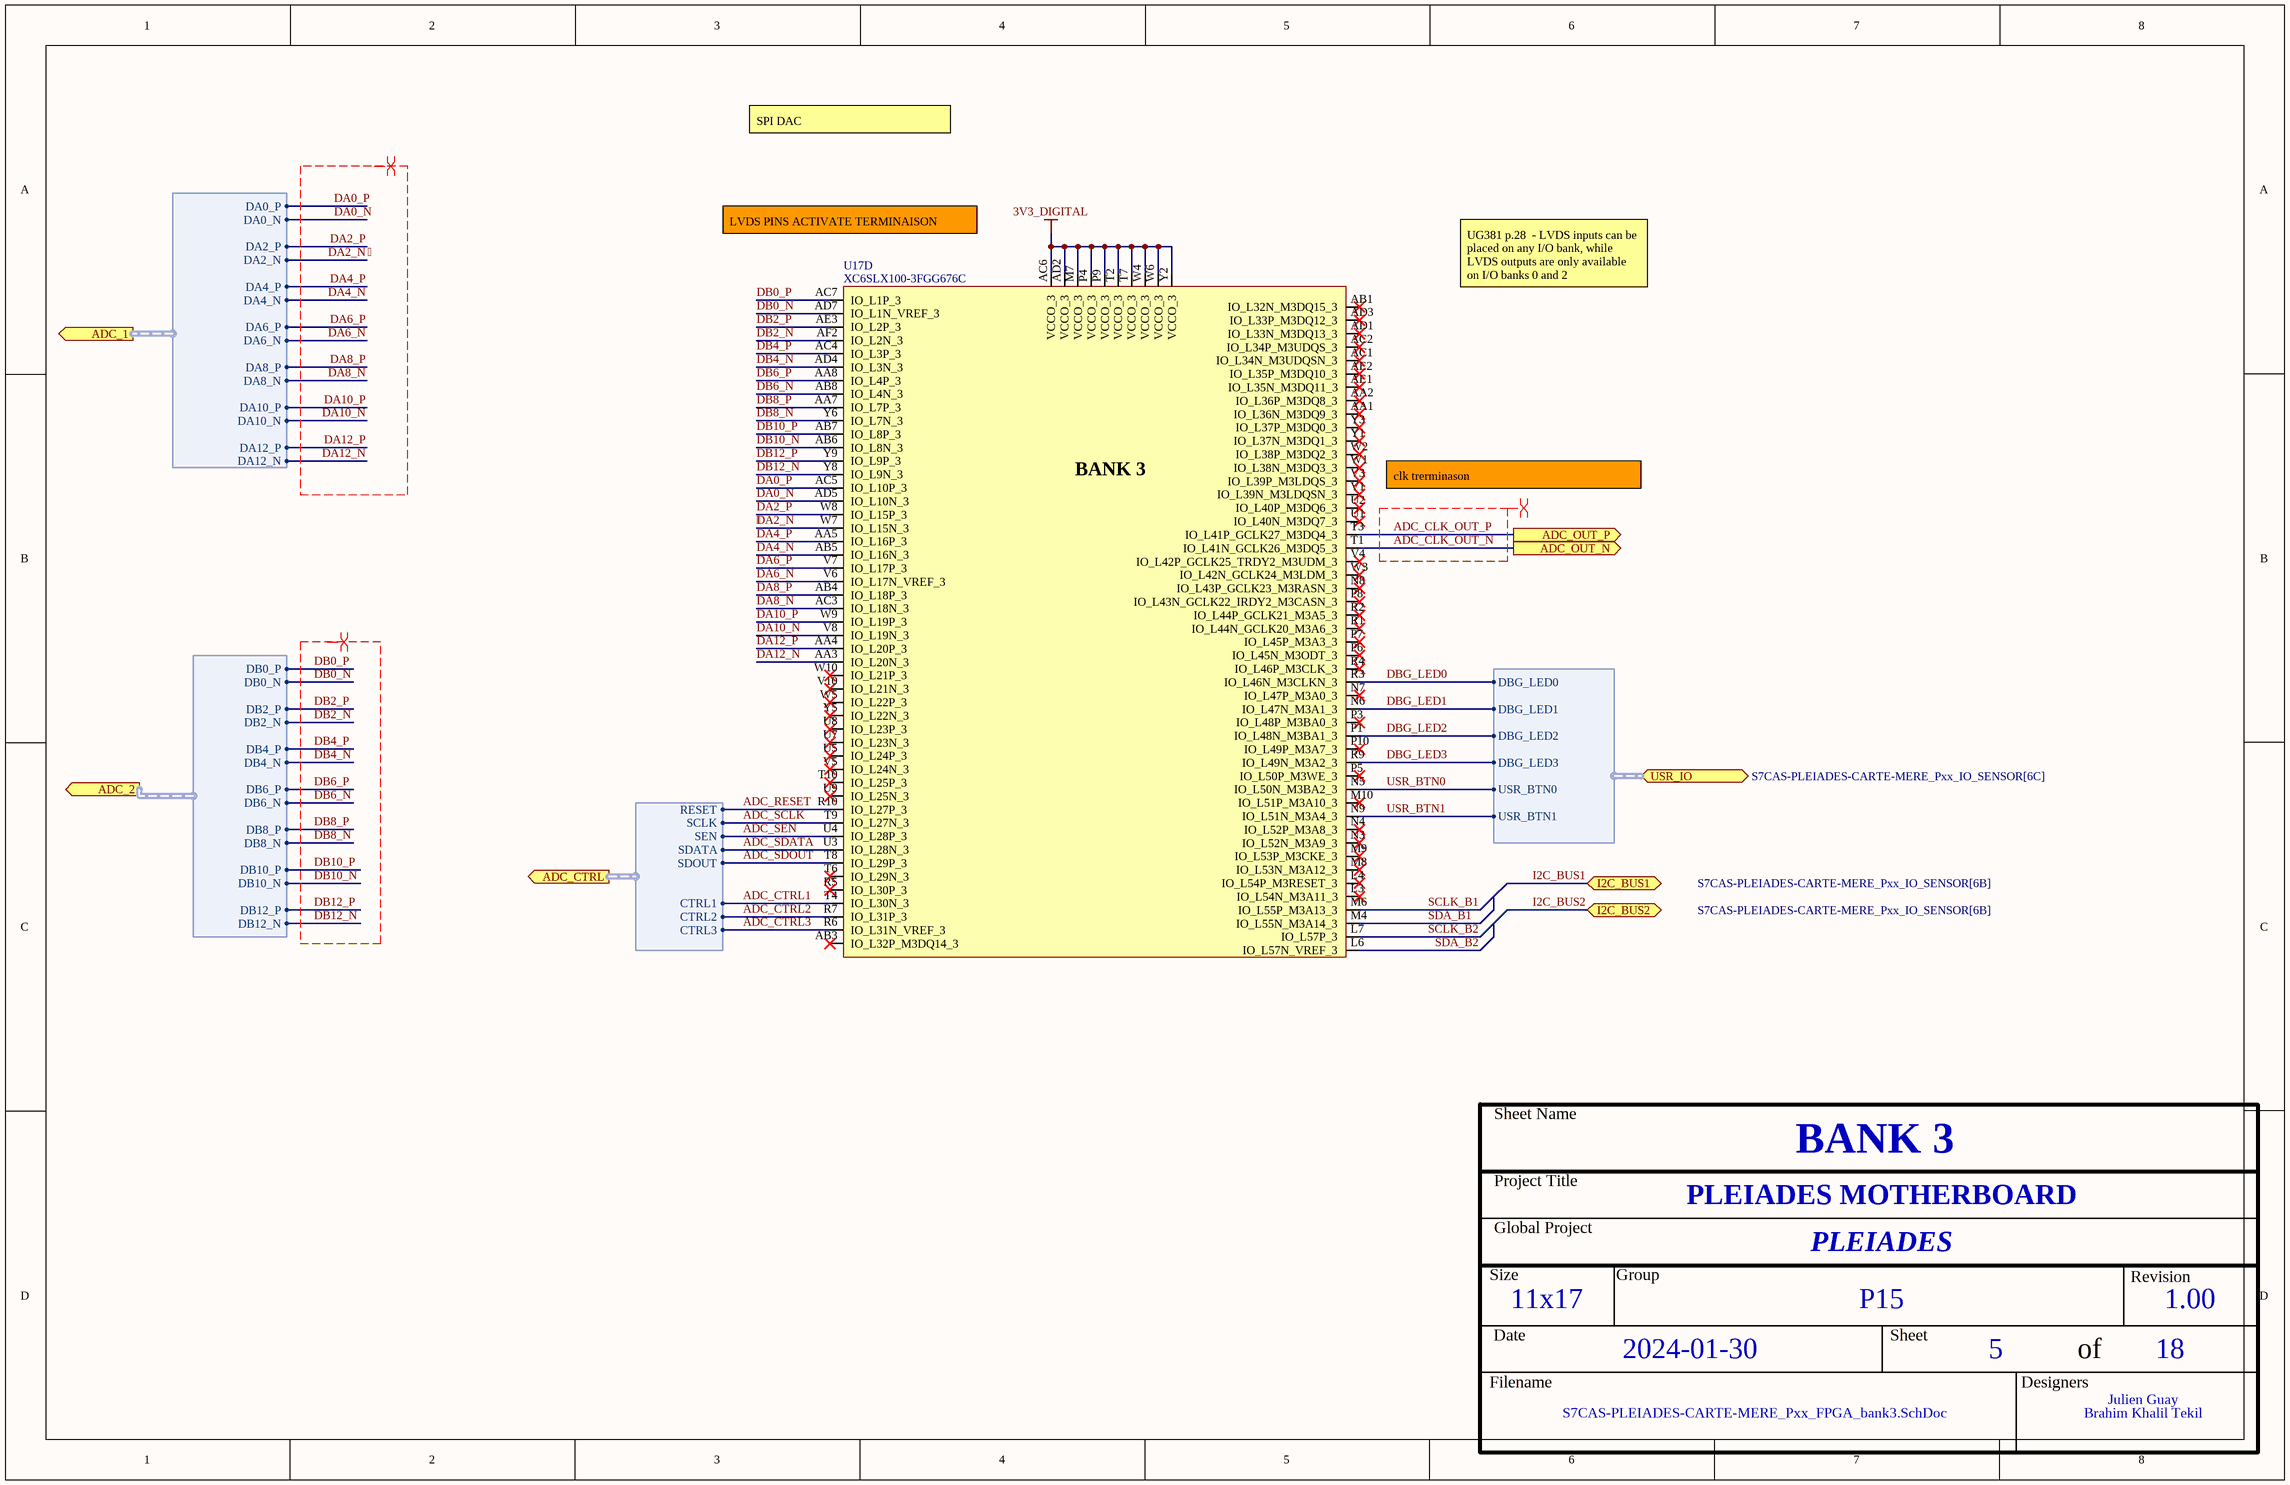
[diagram p3: S7CAS-PLEIADES-CARTE-MERE_Pxx_FPGA_bank3.SchDoc]

### Parts
U17  XC6SLX100-3FGG676C  [FPGA_XILINX_FGG676]  (part D of 10)

### Ports
ADC_1 (out, harness ADC_1_HARNESS, see S7CAS-PLEIADES-CARTE-MERE_Pxx_CAN[5A]), ADC_2 (out, harness ADC_2_HARNESS, see S7CAS-PLEIADES-CARTE-MERE_Pxx_CAN[5C]), ADC_CTRL (out, harness ADC_CTRL_HARNESS, see S7CAS-PLEIADES-CARTE-MERE_Pxx_CAN[2C]), ADC_OUT_N (out, see S7CAS-PLEIADES-CARTE-MERE_Pxx_CAN[4C]), ADC_OUT_P (out, see S7CAS-PLEIADES-CARTE-MERE_Pxx_CAN[4C]), I2C_BUS1 (bidir, see S7CAS-PLEIADES-CARTE-MERE_Pxx_IO_SENSOR[6B]), I2C_BUS2 (bidir, see S7CAS-PLEIADES-CARTE-MERE_Pxx_IO_SENSOR[6B]), USR_IO (bidir, harness USER_IOS_HARNESS, see S7CAS-PLEIADES-CARTE-MERE_Pxx_IO_SENSOR[6C])

### Harnesses
USER_IOS_HARNESS: DBG_LED0, DBG_LED1, DBG_LED2, DBG_LED3, USR_BTN0, USR_BTN1
ADC_CTRL_HARNESS: RESET, SCLK, SEN, SDATA, SDOUT, CTRL1, CTRL2, CTRL3
ADC_1_HARNESS: DA0_P, DA0_N, DA2_P, DA2_N, DA4_P, DA4_N, DA6_P, DA6_N, DA8_P, DA8_N, DA10_P, DA10_N, DA12_P, DA12_N
ADC_2_HARNESS: DB0_P, DB0_N, DB2_P, DB2_N, DB4_P, DB4_N, DB6_P, DB6_N, DB8_P, DB8_N, DB10_P, DB10_N, DB12_P, DB12_N

### Nets
3V3_DIGITAL: U17.AC6(VCCO_3) U17.AD2(VCCO_3) U17.M7(VCCO_3) U17.P4(VCCO_3) U17.P9(VCCO_3) U17.T2(VCCO_3) U17.T7(VCCO_3) U17.W4(VCCO_3) U17.W6(VCCO_3) U17.Y2(VCCO_3)
: U17.W7(IO_L15N_3) ; port ADC_1.DA2_N  [also labelled DA2_N]
ADC_CLK_OUT_N: U17.T1(IO_L41N_GCLK26_M3DQ5_3) ; port ADC_OUT_N
ADC_CLK_OUT_P: U17.T3(IO_L41P_GCLK27_M3DQ4_3) ; port ADC_OUT_P
ADC_CTRL1: U17.T4(IO_L30N_3) ; port ADC_CTRL.CTRL1
ADC_CTRL2: U17.R7(IO_L31P_3) ; port ADC_CTRL.CTRL2
ADC_CTRL3: U17.R6(IO_L31N_VREF_3) ; port ADC_CTRL.CTRL3
ADC_RESET: U17.R10(IO_L27P_3) ; port ADC_CTRL.RESET
ADC_SCLK: U17.T9(IO_L27N_3) ; port ADC_CTRL.SCLK
ADC_SDATA: U17.U3(IO_L28N_3) ; port ADC_CTRL.SDATA
ADC_SDOUT: U17.T8(IO_L29P_3) ; port ADC_CTRL.SDOUT
ADC_SEN: U17.U4(IO_L28P_3) ; port ADC_CTRL.SEN
DA0_N: U17.AD5(IO_L10N_3) ; port ADC_1.DA0_N
DA0_P: U17.AC5(IO_L10P_3) ; port ADC_1.DA0_P
DA2_P: U17.W8(IO_L15P_3) ; port ADC_1.DA2_P
DA4_N: U17.AB5(IO_L16N_3) ; port ADC_1.DA4_N
DA4_P: U17.AA5(IO_L16P_3) ; port ADC_1.DA4_P
DA6_N: U17.V6(IO_L17N_VREF_3) ; port ADC_1.DA6_N
DA6_P: U17.V7(IO_L17P_3) ; port ADC_1.DA6_P
DA8_N: U17.AC3(IO_L18N_3) ; port ADC_1.DA8_N
DA8_P: U17.AB4(IO_L18P_3) ; port ADC_1.DA8_P
DA10_N: U17.V8(IO_L19N_3) ; port ADC_1.DA10_N
DA10_P: U17.W9(IO_L19P_3) ; port ADC_1.DA10_P
DA12_N: U17.AA3(IO_L20N_3) ; port ADC_1.DA12_N
DA12_P: U17.AA4(IO_L20P_3) ; port ADC_1.DA12_P
DB0_N: U17.AD7(IO_L1N_VREF_3) ; port ADC_2.DB0_N
DB0_P: U17.AC7(IO_L1P_3) ; port ADC_2.DB0_P
DB2_N: U17.AF2(IO_L2N_3) ; port ADC_2.DB2_N
DB2_P: U17.AE3(IO_L2P_3) ; port ADC_2.DB2_P
DB4_N: U17.AD4(IO_L3N_3) ; port ADC_2.DB4_N
DB4_P: U17.AC4(IO_L3P_3) ; port ADC_2.DB4_P
DB6_N: U17.AB8(IO_L4N_3) ; port ADC_2.DB6_N
DB6_P: U17.AA8(IO_L4P_3) ; port ADC_2.DB6_P
DB8_N: U17.Y6(IO_L7N_3) ; port ADC_2.DB8_N
DB8_P: U17.AA7(IO_L7P_3) ; port ADC_2.DB8_P
DB10_N: U17.AB6(IO_L8N_3) ; port ADC_2.DB10_N
DB10_P: U17.AB7(IO_L8P_3) ; port ADC_2.DB10_P
DB12_N: U17.Y8(IO_L9N_3) ; port ADC_2.DB12_N
DB12_P: U17.Y9(IO_L9P_3) ; port ADC_2.DB12_P
DBG_LED0: U17.R3(IO_L46N_M3CLKN_3) ; port USR_IO.DBG_LED0
DBG_LED1: U17.N6(IO_L47N_M3A1_3) ; port USR_IO.DBG_LED1
DBG_LED2: U17.P1(IO_L48N_M3BA1_3) ; port USR_IO.DBG_LED2
DBG_LED3: U17.R9(IO_L49N_M3A2_3) ; port USR_IO.DBG_LED3
SCLK_B1: U17.M6(IO_L55P_M3A13_3)
SCLK_B2: U17.L7(IO_L57P_3)
SDA_B1: U17.M4(IO_L55N_M3A14_3)
SDA_B2: U17.L6(IO_L57N_VREF_3)
USR_BTN0: U17.N5(IO_L50N_M3BA2_3) ; port USR_IO.USR_BTN0
USR_BTN1: U17.N9(IO_L51N_M3A4_3) ; port USR_IO.USR_BTN1

Not connected (* = marked no-connect by the designer): U17 AA1(IO_L36N_M3DQ9_3)* AA2(IO_L36P_M3DQ8_3)* AB1(IO_L32N_M3DQ15_3)* AB3(IO_L32P_M3DQ14_3)* AC1(IO_L34N_M3UDQSN_3)* AC2(IO_L34P_M3UDQS_3)* AD1(IO_L33N_M3DQ13_3)* AD3(IO_L33P_M3DQ12_3)* AE1(IO_L35N_M3DQ11_3)* AE2(IO_L35P_M3DQ10_3)* L3(IO_L54N_M3A11_3)* L4(IO_L54P_M3RESET_3)* M8(IO_L53N_M3A12_3)* M9(IO_L53P_M3CKE_3)* M10(IO_L51P_M3A10_3)* N3(IO_L52N_M3A9_3)* N4(IO_L52P_M3A8_3)* N7(IO_L47P_M3A0_3)* N8(IO_L43P_GCLK23_M3RASN_3)* P3(IO_L48P_M3BA0_3)* P5(IO_L50P_M3WE_3)* P6(IO_L45N_M3ODT_3)* P7(IO_L45P_M3A3_3)* P8(IO_L43N_GCLK22_IRDY2_M3CASN_3)* P10(IO_L49P_M3A7_3)* R1(IO_L44N_GCLK20_M3A6_3)* R2(IO_L44P_GCLK21_M3A5_3)* R4(IO_L46P_M3CLK_3)* R5(IO_L30P_3)* T6(IO_L29N_3)* T10(IO_L25P_3)* U1(IO_L40N_M3DQ7_3)* U2(IO_L40P_M3DQ6_3)* U5(IO_L24P_3)* U7(IO_L23N_3)* U8(IO_L23P_3)* U9(IO_L25N_3)* V1(IO_L39N_M3LDQSN_3)* V3(IO_L39P_M3LDQS_3)* V4(IO_L42P_GCLK25_TRDY2_M3UDM_3)* V5(IO_L24N_3)* V10(IO_L21N_3)* W1(IO_L38N_M3DQ3_3)* W2(IO_L38P_M3DQ2_3)* W3(IO_L42N_GCLK24_M3LDM_3)* W5(IO_L22P_3)* W10(IO_L21P_3)* Y1(IO_L37N_M3DQ1_3)* Y3(IO_L37P_M3DQ0_3)* Y5(IO_L22N_3)*

### Buses and harness runs
bus I2C_BUS1 = port I2C_BUS1
bus I2C_BUS2 = port I2C_BUS2

### Layout directives
differential pair: , ADC_CLK_OUT_N, ADC_CLK_OUT_P, DA0_N, DA0_P, DA2_N, DA2_P, DA4_N, DA4_P, DA6_N, DA6_P, DA8_N, DA8_P, DA10_N, DA10_P, DA12_N, DA12_P, DB0_N, DB0_P, DB2_N, DB2_P, DB4_N, DB4_P, DB6_N, DB6_P, DB8_N, DB8_P, DB10_N, DB10_P, DB12_N, DB12_P

### Notes on the sheet
- SPI DAC
- LVDS PINS ACTIVATE TERMINAISON
- UG381 p.28  - LVDS inputs can be placed on any I/O bank, while
  LVDS outputs are only available on I/O banks 0 and 2
- (near U17) clk trerminason
- Sheet Name
- Project Title
- Global Project
- Size
- Group
- Revision
- Date
- Sheet
- of
- Filename
- Designers
- (in symbol FPGA_XC6SLX100-3FGG676C, part D) BANK 3

### Library data of the parts
U17 = FPGA_XC6SLX100-3FGG676C: as U1 on sheet S7CAS-PLEIADES-CARTE-MERE_Pxx_FPGA_bank0_1_5; Current: *; Power: *; Mfg: Xilinx; Mfg Part Number: XC6SLX100-3FGG676C; HelpURL: https://www.xilinx.com/support/documentation/data_sheets/ds162.pdf; CreatedBy: Jonathan Bouchard; Temperature: 0°C ~ 85°C (TJ); Value: *; Precision: *; Package: BGA-676; Supplier 1: Digikey; Supplier Part Number 1: 122-1760-ND

## Sheet S7CAS-PLEIADES-CARTE-MERE_Pxx_FPGA_bank2_4.SchDoc
size Tabloid; SheetNumber: 6; SheetTotal: 18; Sheet_Name: BANK 2 & 4; Size: 11x17
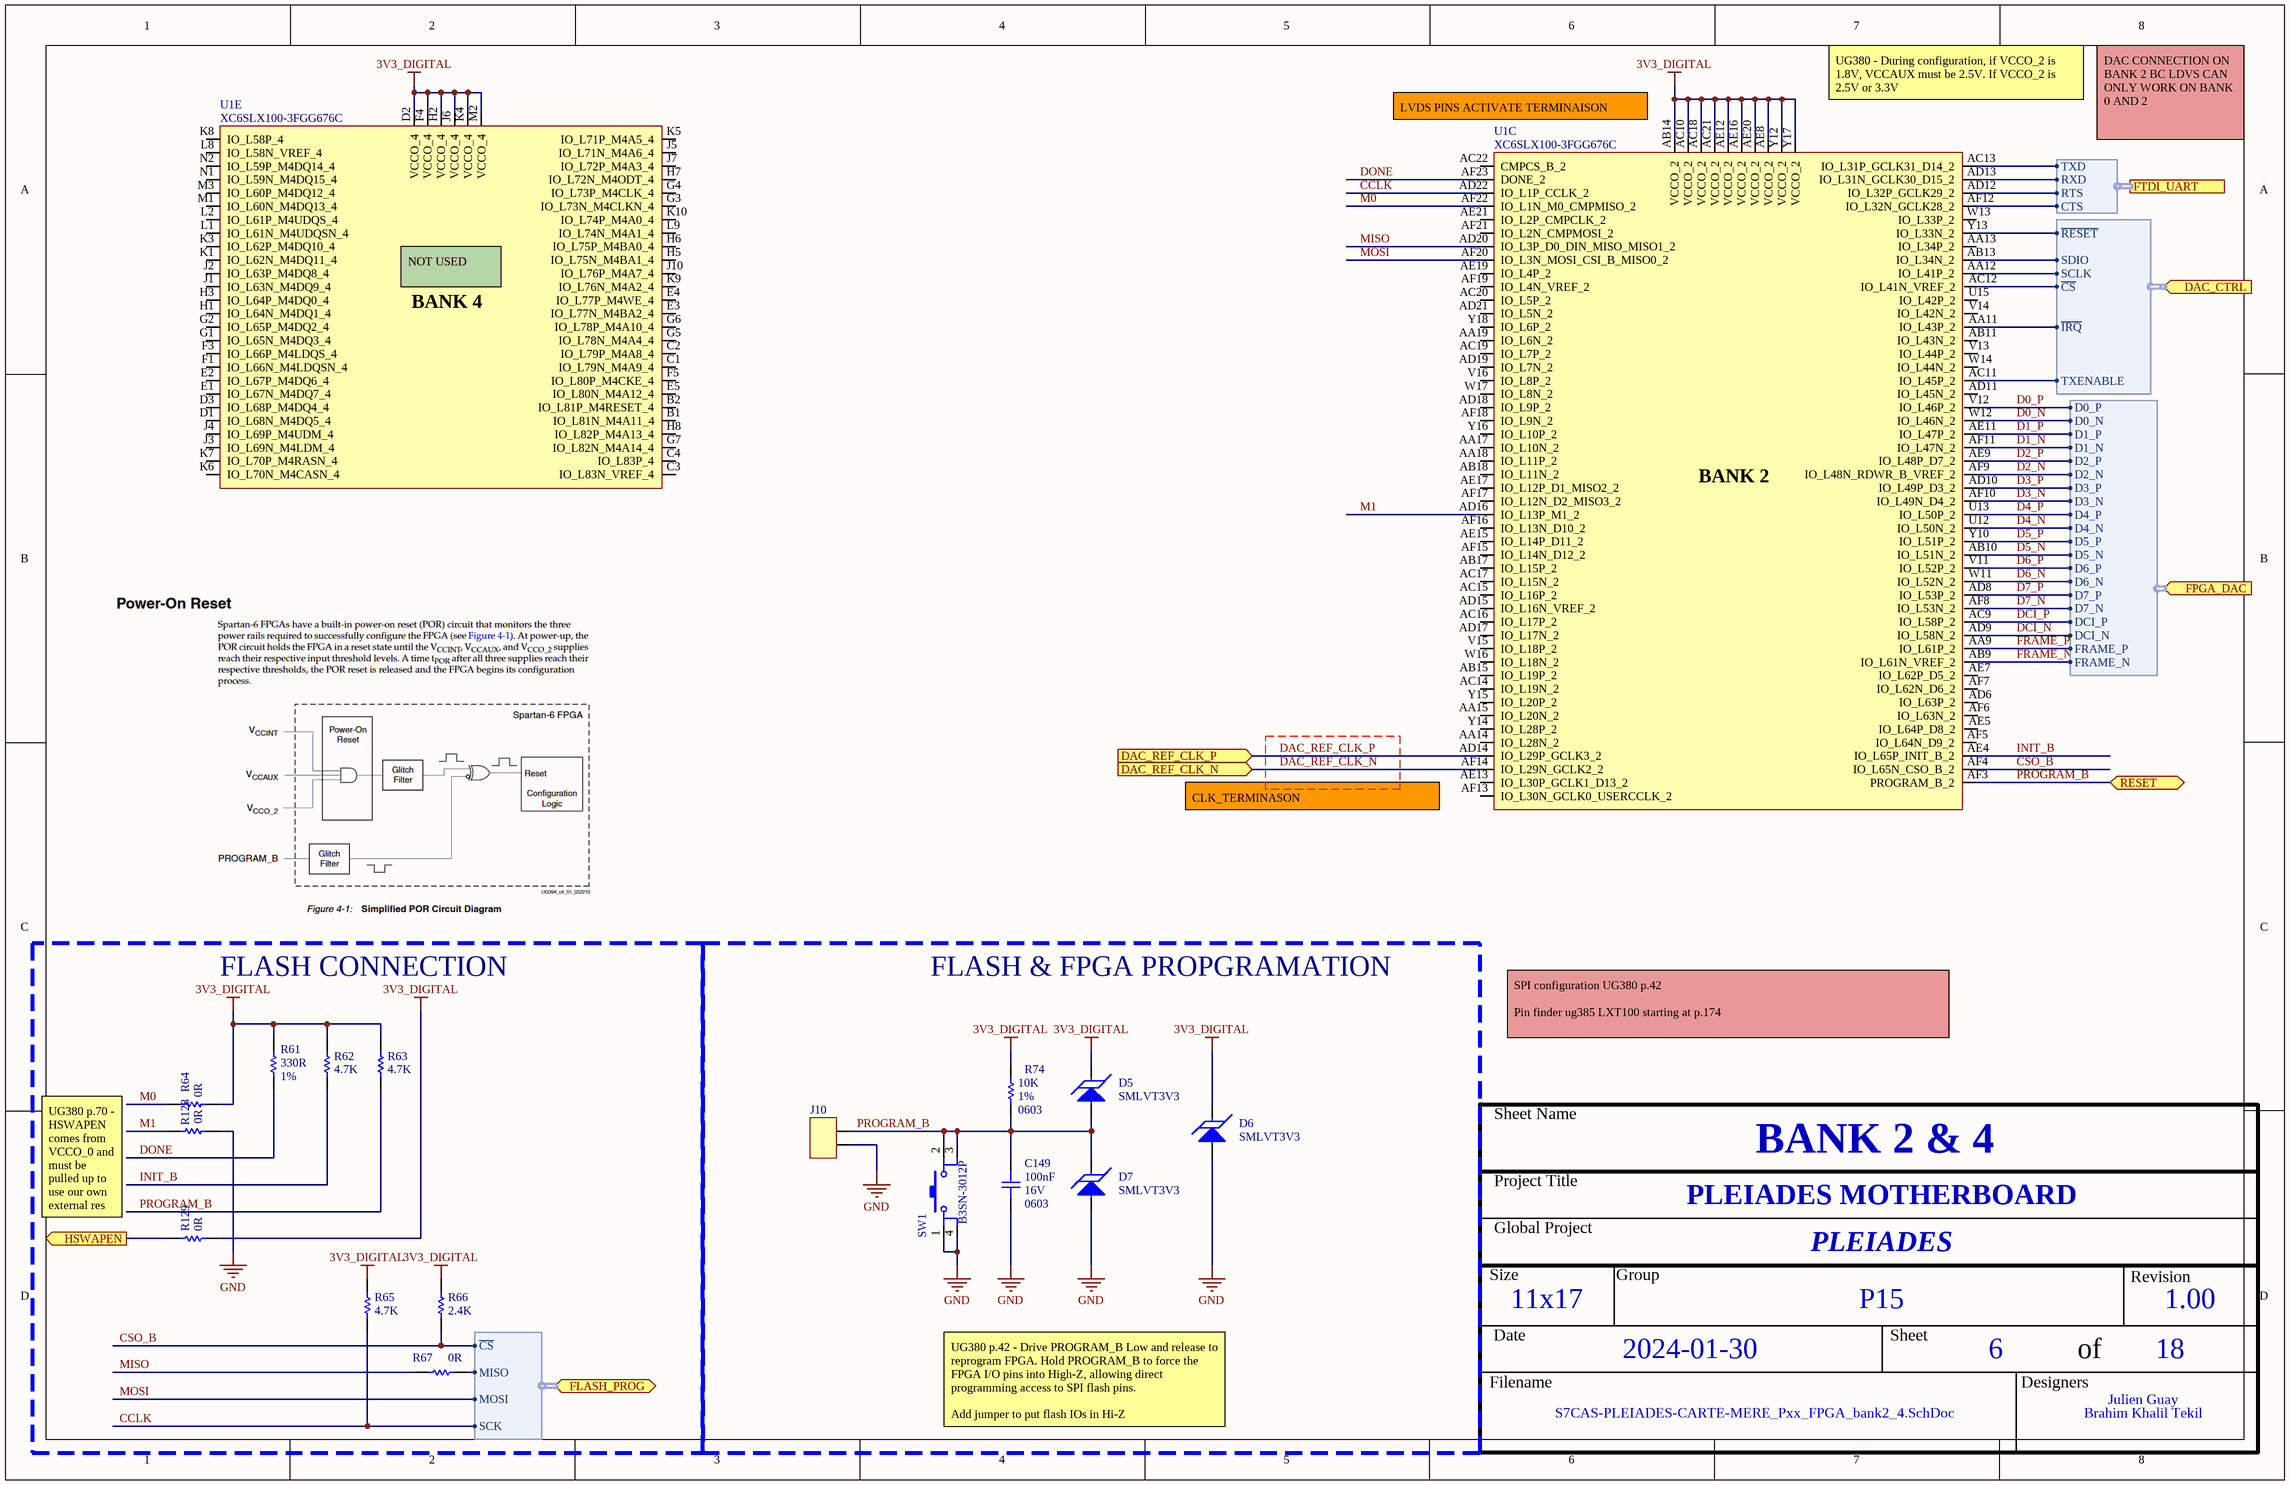
[diagram p4: S7CAS-PLEIADES-CARTE-MERE_Pxx_FPGA_bank2_4.SchDoc]

### Parts
C149  value 100nF  Voltage: 16V  Package: 0603  [CAP_0603]  (hidden comment: CAP - 0603)
D5  SMLVT3V3  [TVS_POW_SMLVT3V3]
D6  SMLVT3V3  [TVS_POW_SMLVT3V3]
D7  SMLVT3V3  [TVS_POW_SMLVT3V3]
J10  Part Number  [MALE HEADER - 1x2 2.54mm]  (value not drawn)
R61  value 330R  Precision: 1%  [RES_0603]  (hidden comment: RES - 0603)
R62  value 4.7K  [RES_0603]  (hidden comment: RES - 0603)
R63  value 4.7K  [RES_0603]  (hidden comment: RES - 0603)
R64  value 0R  [RES_0603]  (hidden comment: RES - 0603)
R65  value 4.7K  [RES_0603]  (hidden comment: RES - 0603)
R66  value 2.4K  [RES_0603]  (hidden comment: RES - 0603)
R67  value 0R  [RES_0603]  (hidden comment: RES - 0603)
R74  value 10K  Package: 0603  Precision: 1%  [RES_0603]  (hidden comment: RES - 0603)
R128  value 0R  [RES_0603]  (hidden comment: RES - 0603)
R129  value 0R  [RES_0603]  (hidden comment: RES - 0603)
SW1  B3SN-3012P  [SWI_TACT_B3SN-3012P]
U1  XC6SLX100-3FGG676C  [FPGA_XILINX_FGG676]  (parts C,E of 10)

### Blocks framed on the sheet
FLASH CONNECTION: R61-R67 R128 R129
FLASH & FPGA PROPGRAMATION: C149 D5-D7 J10 R74 SW1

### Ports
DAC_CTRL (in, harness DAC_CTRL_HARNESS, see S7CAS-PLEIADES-CARTE-MERE_Pxx_CNA[2C]), DAC_REF_CLK_N (in, see S7CAS-PLEIADES-CARTE-MERE_Pxx_CNA[2C]), DAC_REF_CLK_P (in, see S7CAS-PLEIADES-CARTE-MERE_Pxx_CNA[2C]), FLASH_PROG (bidir, harness FLASH_PROG, see S7CAS-PLEIADES-CARTE-MERE_Pxx_FLASH_PHY_CLOCK[2D]), FPGA_DAC (in, harness DAC_HARNESS, see S7CAS-PLEIADES-CARTE-MERE_Pxx_CNA[2A]), FTDI_UART (harness FTDI_HARNESS, see S7CAS-PLEIADES-CARTE-MERE_Pxx_DEBUG_USB[2D]), HSWAPEN (out, see S7CAS-PLEIADES-CARTE-MERE_Pxx_FPGA_bank0_1_5[1A]), RESET (bidir, see S7CAS-PLEIADES-CARTE-MERE_Pxx_DEBUG_USB[2D])

### Harnesses
FLASH_PROG: MISO, MOSI, SCK, ~{CS}
FTDI_HARNESS: TXD, RXD, RTS, CTS
DAC_HARNESS: D0_P, D1_P, D2_P, D3_P, D4_P, D5_P, D6_P, D7_P, DCI_P, DCI_N, FRAME_P, FRAME_N, D2_N, D4_N, D6_N, D7_N, D5_N, D1_N, D3_N, D0_N
DAC_CTRL_HARNESS: ~{RESET}, SDIO, ~{CS}, SCLK, ~{IRQ}, TXENABLE

### Nets
3V3_DIGITAL: D5.K D6.K R61.2 R62.2 R63.2 R64.2 R65.2 R66.2 R74.2 R129.2 U1.AB14(VCCO_2) U1.AC10(VCCO_2) U1.AC18(VCCO_2) U1.AC21(VCCO_2) U1.AE8(VCCO_2) U1.AE12(VCCO_2) U1.AE16(VCCO_2) U1.AE20(VCCO_2) U1.D2(VCCO_4) U1.F4(VCCO_4) U1.H2(VCCO_4) U1.J6(VCCO_4) U1.K4(VCCO_4) U1.M2(VCCO_4) U1.Y12(VCCO_2) U1.Y17(VCCO_2)
GND: C149.1 D6.A D7.A J10.2 R128.2 SW1.1 SW1.4  [project net nCS]
CCLK: R65.1 U1.AD22(IO_L1P_CCLK_2) ; port FLASH_PROG.SCK
CSO_B: R66.1 U1.AF4(IO_L65N_CSO_B_2) ; port FLASH_PROG.~{CS}
D0_N: U1.W12(IO_L46N_2) ; port FPGA_DAC.D0_N
D0_P: U1.V12(IO_L46P_2) ; port FPGA_DAC.D0_P
D1_N: U1.AF11(IO_L47N_2) ; port FPGA_DAC.D1_N
D1_P: U1.AE11(IO_L47P_2) ; port FPGA_DAC.D1_P
D2_N: U1.AF9(IO_L48N_RDWR_B_VREF_2) ; port FPGA_DAC.D2_N
D2_P: U1.AE9(IO_L48P_D7_2) ; port FPGA_DAC.D2_P
D3_N: U1.AF10(IO_L49N_D4_2) ; port FPGA_DAC.D3_N
D3_P: U1.AD10(IO_L49P_D3_2) ; port FPGA_DAC.D3_P
D4_N: U1.U12(IO_L50N_2) ; port FPGA_DAC.D4_N
D4_P: U1.U13(IO_L50P_2) ; port FPGA_DAC.D4_P
D5_N: U1.AB10(IO_L51N_2) ; port FPGA_DAC.D5_N
D5_P: U1.Y10(IO_L51P_2) ; port FPGA_DAC.D5_P
D6_N: U1.W11(IO_L52N_2) ; port FPGA_DAC.D6_N
D6_P: U1.V11(IO_L52P_2) ; port FPGA_DAC.D6_P
D7_N: U1.AF8(IO_L53N_2) ; port FPGA_DAC.D7_N
D7_P: U1.AD8(IO_L53P_2) ; port FPGA_DAC.D7_P
DAC_REF_CLK_N: U1.AF14(IO_L29N_GCLK2_2) ; port DAC_REF_CLK_N
DAC_REF_CLK_P: U1.AD14(IO_L29P_GCLK3_2) ; port DAC_REF_CLK_P
DCI_N: U1.AD9(IO_L58N_2) ; port FPGA_DAC.DCI_N
DCI_P: U1.AC9(IO_L58P_2) ; port FPGA_DAC.DCI_P
DONE: R61.1 U1.AF23(DONE_2)
FRAME_N: U1.AB9(IO_L61N_VREF_2) ; port FPGA_DAC.FRAME_N
FRAME_P: U1.AA9(IO_L61P_2) ; port FPGA_DAC.FRAME_P
HSWAPEN: R129.1 ; port HSWAPEN
INIT_B: R62.1 U1.AE4(IO_L65P_INIT_B_2)
M0: R64.1 U1.AF22(IO_L1N_M0_CMPMISO_2)
M1: R128.1 U1.AD16(IO_L13P_M1_2)
MISO: R67.2 U1.AD20(IO_L3P_D0_DIN_MISO_MISO1_2)
MOSI: U1.AF20(IO_L3N_MOSI_CSI_B_MISO0_2) ; port FLASH_PROG.MOSI
PROGRAM_B: C149.2 D5.A D7.K J10.1 R63.1 R74.1 SW1.2 SW1.3 U1.AF3(PROGRAM_B_2) ; port RESET
NetM1_3: U1.AF12(IO_L32N_GCLK28_2) ; port FTDI_UART.CTS
NetM1_4: U1.AD12(IO_L32P_GCLK29_2) ; port FTDI_UART.RTS
NetM1_5: U1.AD13(IO_L31N_GCLK30_D15_2) ; port FTDI_UART.RXD
NetM1_6: U1.AC13(IO_L31P_GCLK31_D14_2) ; port FTDI_UART.TXD
NetR67_1: R67.1 ; port FLASH_PROG.MISO
NetU1_AA11: U1.AA11(IO_L43P_2) ; port DAC_CTRL.~{IRQ}
NetU1_AA12: U1.AA12(IO_L41P_2) ; port DAC_CTRL.SCLK
NetU1_AB13: U1.AB13(IO_L34N_2) ; port DAC_CTRL.SDIO
NetU1_AC11: U1.AC11(IO_L45P_2) ; port DAC_CTRL.TXENABLE
NetU1_AC12: U1.AC12(IO_L41N_VREF_2) ; port DAC_CTRL.~{CS}
NetU1_Y13: U1.Y13(IO_L33N_2) ; port DAC_CTRL.~{RESET}

Not connected (* = marked no-connect by the designer): U1 AA13(IO_L34P_2) AA14(IO_L28N_2) AA15(IO_L20N_2) AA17(IO_L10N_2) AA18(IO_L11P_2) AA19(IO_L6N_2) AB11(IO_L43N_2) AB15(IO_L19P_2) AB17(IO_L15P_2) AB18(IO_L11N_2) AC14(IO_L19N_2) AC15(IO_L16P_2) AC16(IO_L17P_2) AC17(IO_L15N_2) AC19(IO_L7P_2) AC20(IO_L5P_2) AC22(CMPCS_B_2) AD6(IO_L63P_2) AD11(IO_L45N_2) AD15(IO_L16N_VREF_2) AD17(IO_L17N_2) AD18(IO_L9P_2) AD19(IO_L7N_2) AD21(IO_L5N_2) AE5(IO_L64P_D8_2) AE7(IO_L62P_D5_2) AE13(IO_L30P_GCLK1_D13_2) AE15(IO_L14P_D11_2) AE17(IO_L12P_D1_MISO2_2) AE19(IO_L4P_2) AE21(IO_L2P_CMPCLK_2) AF5(IO_L64N_D9_2) AF6(IO_L63N_2) AF7(IO_L62N_D6_2) AF13(IO_L30N_GCLK0_USERCCLK_2) AF15(IO_L14N_D12_2) AF16(IO_L13N_D10_2) AF17(IO_L12N_D2_MISO3_2) AF18(IO_L9N_2) AF19(IO_L4N_VREF_2) AF21(IO_L2N_CMPMOSI_2) B1(IO_L81N_M4A11_4) B2(IO_L81P_M4RESET_4) C1(IO_L79N_M4A9_4) C2(IO_L79P_M4A8_4) C3(IO_L83N_VREF_4) C4(IO_L83P_4) D1(IO_L68N_M4DQ5_4) D3(IO_L68P_M4DQ4_4) E1(IO_L67N_M4DQ7_4) E2(IO_L67P_M4DQ6_4) E3(IO_L77N_M4BA2_4) E4(IO_L77P_M4WE_4) E5(IO_L80N_M4A12_4) F1(IO_L66N_M4LDQSN_4) F3(IO_L66P_M4LDQS_4) F5(IO_L80P_M4CKE_4) G1(IO_L65N_M4DQ3_4) G2(IO_L65P_M4DQ2_4) G3(IO_L73N_M4CLKN_4) G4(IO_L73P_M4CLK_4) G5(IO_L78N_M4A4_4) G6(IO_L78P_M4A10_4) G7(IO_L82N_M4A14_4) H1(IO_L64N_M4DQ1_4) H3(IO_L64P_M4DQ0_4) H5(IO_L75N_M4BA1_4) H6(IO_L75P_M4BA0_4) H7(IO_L72N_M4ODT_4) H8(IO_L82P_M4A13_4) J1(IO_L63N_M4DQ9_4) J2(IO_L63P_M4DQ8_4) J3(IO_L69N_M4LDM_4) J4(IO_L69P_M4UDM_4) J5(IO_L71N_M4A6_4) J7(IO_L72P_M4A3_4) J10(IO_L76P_M4A7_4) K1(IO_L62N_M4DQ11_4) K3(IO_L62P_M4DQ10_4) K5(IO_L71P_M4A5_4) K6(IO_L70N_M4CASN_4) K7(IO_L70P_M4RASN_4) K8(IO_L58P_4) K9(IO_L76N_M4A2_4) K10(IO_L74P_M4A0_4) L1(IO_L61N_M4UDQSN_4) L2(IO_L61P_M4UDQS_4) L8(IO_L58N_VREF_4) L9(IO_L74N_M4A1_4) M1(IO_L60N_M4DQ13_4) M3(IO_L60P_M4DQ12_4) N1(IO_L59N_M4DQ15_4) N2(IO_L59P_M4DQ14_4) U15(IO_L42P_2) V13(IO_L44P_2) V14(IO_L42N_2) V15(IO_L18P_2) V16(IO_L8P_2) W13(IO_L33P_2) W14(IO_L44N_2) W16(IO_L18N_2) W17(IO_L8N_2) Y14(IO_L28P_2) Y15(IO_L20P_2) Y16(IO_L10P_2) Y18(IO_L6P_2)

### Notes on the sheet
- UG380 - During configuration, if VCCO_2 is 1.8V, VCCAUX must be 2.5V. If VCCO_2 is 2.5V or 3.3V
- (near U1) LVDS PINS ACTIVATE TERMINAISON
- DAC CONNECTION ON BANK 2 BC LDVS CAN ONLY WORK ON BANK 0 AND 2
- (near U1) NOT USED
- CLK_TERMINASON
- SPI configuration UG380 p.42
  Pin finder ug385 LXT100 starting at p.174
- UG380 p.70 - HSWAPEN comes from VCCO_0 and must be pulled up to use our own external res
- UG380 p.42 - Drive PROGRAM_B Low and release to reprogram FPGA. Hold PROGRAM_B to force the FPGA I/O pins into High-Z, allowing direct programming access to SPI flash pins.
  Add jumper to put flash IOs in Hi-Z
- Sheet Name
- Project Title
- Global Project
- Size
- Group
- Revision
- Date
- Sheet
- of
- Filename
- Designers
- (in symbol FPGA_XC6SLX100-3FGG676C, part C) BANK 2
- (in symbol FPGA_XC6SLX100-3FGG676C, part E) BANK 4

### Library data of the parts
C149 = CAP - 0603: Precision: 10%; Current: *; CreatedBy: Jonathan Bouchard; Power: *; Supplier 1: Arrow Electronics; Supplier Part Number 1: CL10B104KO8NNNC
D5-D7 = TVS_POW_SMLVT3V3: TVS - 3.3V 10.3V 600W - DO214AA; Manufacturer #1: STMicroelectronics; Value: Vbr = 4.1V -  Clamp = 10.3V; Voltage Rating: 3.3V Standoff; Current Rating: 200A (Ifsm); Power Max: 600W (Ppp); GRAMS Lib Spec: 2.8; Magnetic Material: UNKNOWN; Polarized: YES; Tolerance: *; HelpURL: https://www.st.com/content/ccc/resource/technical/document/datasheet/da/a4/86/90/17/13/47/7c/CD00000923.pdf/files/CD00000923.pdf/jcr:content/translations/en.CD00000923.pdf; CreatedBy/Date: Jonathan Bouchard - 2019-04-27; VerifiedBy: Nicolas V. (2019-05-06); Temperature: -55°C ~ 175°C (TJ); Package: DO214AA; Manufacturer #2: *; Note: *; Assembly Type: SMD; Part Number #2: *; Part Number #1: SMLVT3V3; Supplier 1: Digi-Key; Supplier Part Number 1: 497-2496-1-ND; Cryo: UNKNOWN
J10 = MALE HEADER - 1x2 2.54mm: MALE HEADER - 2.54mm 1x2; GRAMS Lib Spec: 2.7
R62-R67 R128 R129 = RES - 0603: Precision: 1%; Current: *; CreatedBy: Jonathan Bouchard; Package: 0603
  R62 R63 R65: Supplier 1: Arrow Electronics; Supplier Part Number 1: RMCF0603FT4K70
  R64 R67 R128 R129: Supplier 1: Arrow Electronics; Supplier Part Number 1: RMCF0603ZT0R00
  R66: Supplier 1: Mouser; Supplier Part Number 1: 603-RC0603FR-132K4L
SW1 = SWI_TACT_B3SN-3012P: SWI - TACT SPST-NO 0.05A 24V - 4-SMD; Current: 50mA; Mfg: Omron; Mfg Part Number: B3SN-3012P; HelpURL: http://www.omron.com/ecb/products/pdf/en-b3sn.pdf; CreatedBy: Jonathan Bouchard; Temperature: -25°C ~ 70°C; Power: *; Precision: *; Package: 4-SMD; Value: *; Voltage: 24V; Supplier 1: Digikey; Supplier Part Number 1: SW261CT-ND
U1 = FPGA_XC6SLX100-3FGG676C: as U1 on sheet S7CAS-PLEIADES-CARTE-MERE_Pxx_FPGA_bank0_1_5; Current: *; Power: *; Mfg: Xilinx; Mfg Part Number: XC6SLX100-3FGG676C; HelpURL: https://www.xilinx.com/support/documentation/data_sheets/ds162.pdf; CreatedBy: Jonathan Bouchard; Temperature: 0°C ~ 85°C (TJ); Value: *; Precision: *; Package: BGA-676; Supplier 1: Digikey; Supplier Part Number 1: 122-1760-ND
R61 R74 = RES - 0603: Current: *; CreatedBy: Jonathan Bouchard
  R61: Package: 0603
  R74: Supplier 1: Arrow Electronics; Supplier Part Number 1: RMCF0603FT10K0

## Sheet S7CAS-PLEIADES-CARTE-MERE_Pxx_POWER_FPGA.SchDoc
size Tabloid; SheetNumber: 7; SheetTotal: 18; Sheet_Name: POWER FPGA; Size: 11x17
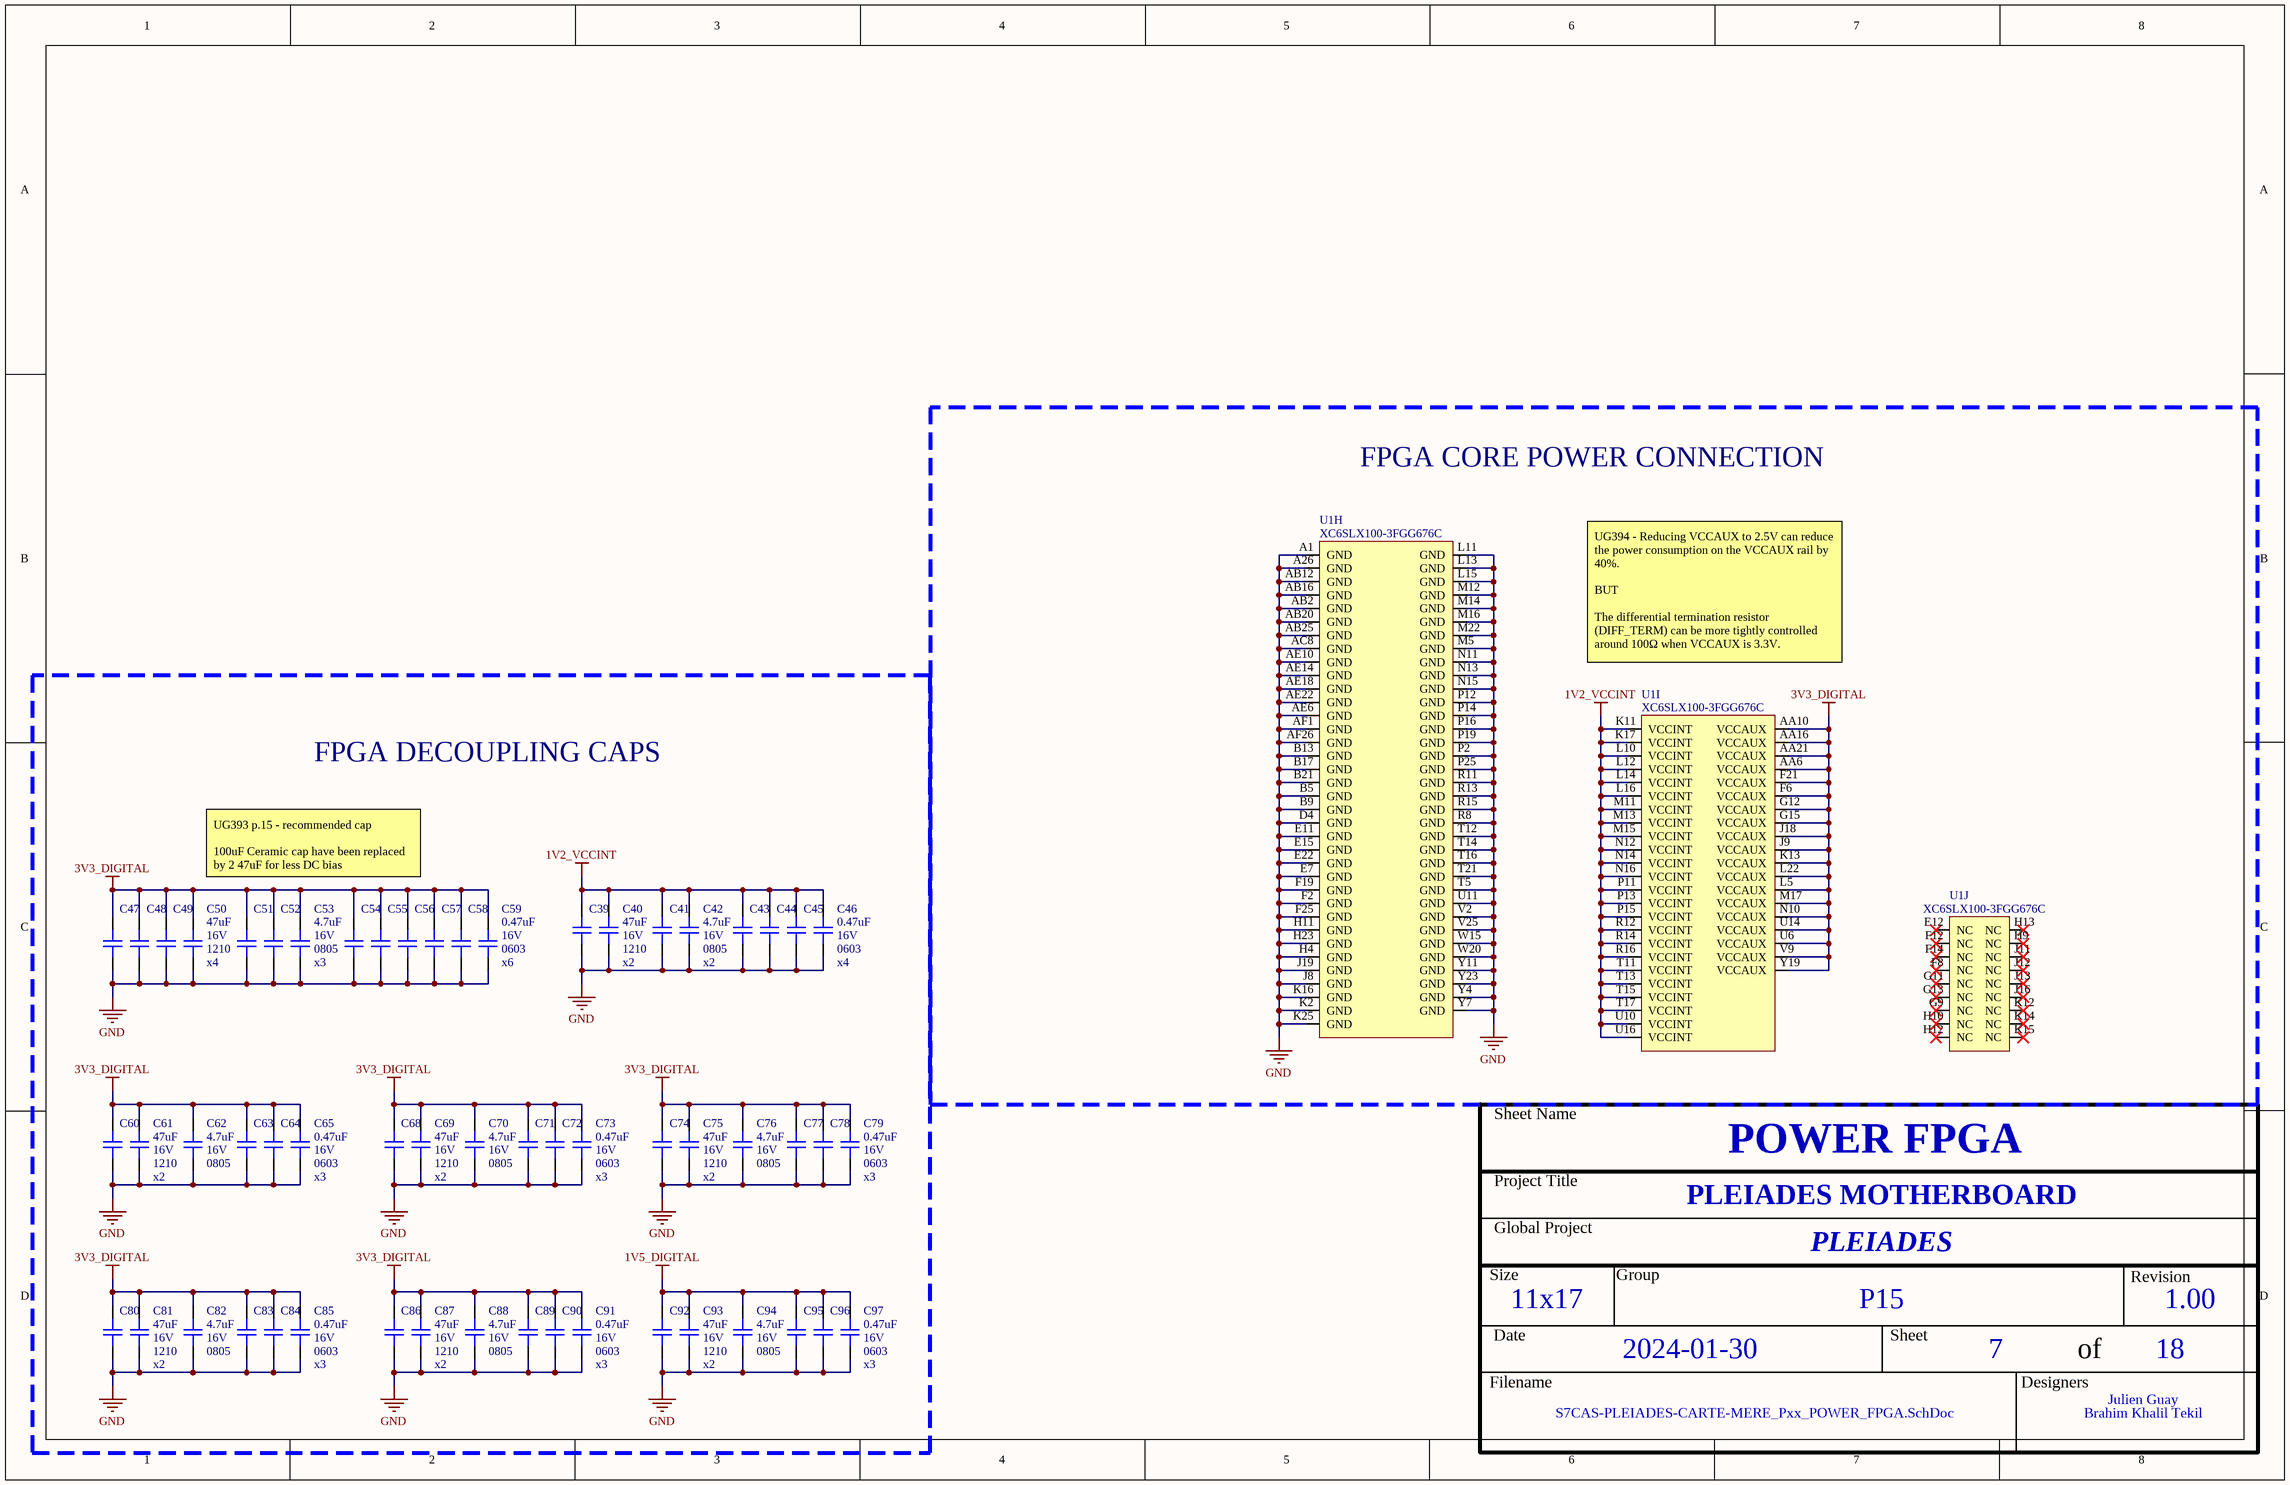
[diagram p5: S7CAS-PLEIADES-CARTE-MERE_Pxx_POWER_FPGA.SchDoc]

### Parts
C39  CAP - 1210  [CAP_1210]  (value not drawn)
C40  value 47uF  Voltage: 16V  Package: 1210  [CAP_1210]  (hidden comment: CAP - 1210)
C41  CAP - 0805  [CAP_0805]  (value not drawn)
C42  value 4.7uF  Voltage: 16V  Package: 0805  [CAP_0805]  (hidden comment: CAP - 0805)
C43  CAP - 0603  [CAP_0603]  (value not drawn)
C44  CAP - 0603  [CAP_0603]  (value not drawn)
C45  CAP - 0603  [CAP_0603]  (value not drawn)
C46  value 0.47uF  Voltage: 16V  Package: 0603  [CAP_0603]  (hidden comment: CAP - 0603)
C47  CAP - 1210  [CAP_1210]  (value not drawn)
C48  CAP - 1210  [CAP_1210]  (value not drawn)
C49  CAP - 1210  [CAP_1210]  (value not drawn)
C50  value 47uF  Voltage: 16V  Package: 1210  [CAP_1210]  (hidden comment: CAP - 1210)
C51  CAP - 0805  [CAP_0805]  (value not drawn)
C52  CAP - 0805  [CAP_0805]  (value not drawn)
C53  value 4.7uF  Voltage: 16V  Package: 0805  [CAP_0805]  (hidden comment: CAP - 0805)
C54  CAP - 0603  [CAP_0603]  (value not drawn)
C55  CAP - 0603  [CAP_0603]  (value not drawn)
C56  CAP - 0603  [CAP_0603]  (value not drawn)
C57  CAP - 0603  [CAP_0603]  (value not drawn)
C58  CAP - 0603  [CAP_0603]  (value not drawn)
C59  value 0.47uF  Voltage: 16V  Package: 0603  [CAP_0603]  (hidden comment: CAP - 0603)
C60  CAP - 1210  [CAP_1210]  (value not drawn)
C61  value 47uF  Voltage: 16V  Package: 1210  [CAP_1210]  (hidden comment: CAP - 1210)
C62  value 4.7uF  Voltage: 16V  Package: 0805  [CAP_0805]  (hidden comment: CAP - 0805)
C63  CAP - 0603  [CAP_0603]  (value not drawn)
C64  CAP - 0603  [CAP_0603]  (value not drawn)
C65  value 0.47uF  Voltage: 16V  Package: 0603  [CAP_0603]  (hidden comment: CAP - 0603)
C68  CAP - 1210  [CAP_1210]  (value not drawn)
C69  value 47uF  Voltage: 16V  Package: 1210  [CAP_1210]  (hidden comment: CAP - 1210)
C70  value 4.7uF  Voltage: 16V  Package: 0805  [CAP_0805]  (hidden comment: CAP - 0805)
C71  CAP - 0603  [CAP_0603]  (value not drawn)
C72  CAP - 0603  [CAP_0603]  (value not drawn)
C73  value 0.47uF  Voltage: 16V  Package: 0603  [CAP_0603]  (hidden comment: CAP - 0603)
C74  CAP - 1210  [CAP_1210]  (value not drawn)
C75  value 47uF  Voltage: 16V  Package: 1210  [CAP_1210]  (hidden comment: CAP - 1210)
C76  value 4.7uF  Voltage: 16V  Package: 0805  [CAP_0805]  (hidden comment: CAP - 0805)
C77  CAP - 0603  [CAP_0603]  (value not drawn)
C78  CAP - 0603  [CAP_0603]  (value not drawn)
C79  value 0.47uF  Voltage: 16V  Package: 0603  [CAP_0603]  (hidden comment: CAP - 0603)
C80  CAP - 1210  [CAP_1210]  (value not drawn)
C81  value 47uF  Voltage: 16V  Package: 1210  [CAP_1210]  (hidden comment: CAP - 1210)
C82  value 4.7uF  Voltage: 16V  Package: 0805  [CAP_0805]  (hidden comment: CAP - 0805)
C83  CAP - 0603  [CAP_0603]  (value not drawn)
C84  CAP - 0603  [CAP_0603]  (value not drawn)
C85  value 0.47uF  Voltage: 16V  Package: 0603  [CAP_0603]  (hidden comment: CAP - 0603)
C86  CAP - 1210  [CAP_1210]  (value not drawn)
C87  value 47uF  Voltage: 16V  Package: 1210  [CAP_1210]  (hidden comment: CAP - 1210)
C88  value 4.7uF  Voltage: 16V  Package: 0805  [CAP_0805]  (hidden comment: CAP - 0805)
C89  CAP - 0603  [CAP_0603]  (value not drawn)
C90  CAP - 0603  [CAP_0603]  (value not drawn)
C91  value 0.47uF  Voltage: 16V  Package: 0603  [CAP_0603]  (hidden comment: CAP - 0603)
C92  CAP - 1210  [CAP_1210]  (value not drawn)
C93  value 47uF  Voltage: 16V  Package: 1210  [CAP_1210]  (hidden comment: CAP - 1210)
C94  value 4.7uF  Voltage: 16V  Package: 0805  [CAP_0805]  (hidden comment: CAP - 0805)
C95  CAP - 0603  [CAP_0603]  (value not drawn)
C96  CAP - 0603  [CAP_0603]  (value not drawn)
C97  value 0.47uF  Voltage: 16V  Package: 0603  [CAP_0603]  (hidden comment: CAP - 0603)
U1  XC6SLX100-3FGG676C  [FPGA_XILINX_FGG676]  (parts H,I,J of 10)

### Blocks framed on the sheet
FPGA CORE POWER CONNECTION: U1
FPGA DECOUPLING CAPS: C39-C65 C68-C97

### Nets
1V2_VCCINT: C39.2 C40.2 C41.2 C42.2 C43.2 C44.2 C45.2 C46.2 U1.K11(VCCINT) U1.K17(VCCINT) U1.L10(VCCINT) U1.L12(VCCINT) U1.L14(VCCINT) U1.L16(VCCINT) U1.M11(VCCINT) U1.M13(VCCINT) U1.M15(VCCINT) U1.N12(VCCINT) U1.N14(VCCINT) U1.N16(VCCINT) U1.P11(VCCINT) U1.P13(VCCINT) U1.P15(VCCINT) U1.R12(VCCINT) U1.R14(VCCINT) U1.R16(VCCINT) U1.T11(VCCINT) U1.T13(VCCINT) U1.T15(VCCINT) U1.T17(VCCINT) U1.U10(VCCINT) U1.U16(VCCINT)
1V5_DIGITAL: C92.2 C93.2 C94.2 C95.2 C96.2 C97.2
3V3_DIGITAL: C47.2 C48.2 C49.2 C50.2 C51.2 C52.2 C53.2 C54.2 C55.2 C56.2 C57.2 C58.2 C59.2 C60.2 C61.2 C62.2 C63.2 C64.2 C65.2 C68.2 C69.2 C70.2 C71.2 C72.2 C73.2 C74.2 C75.2 C76.2 C77.2 C78.2 C79.2 C80.2 C81.2 C82.2 C83.2 C84.2 C85.2 C86.2 C87.2 C88.2 C89.2 C90.2 C91.2 U1.AA6(VCCAUX) U1.AA10(VCCAUX) U1.AA16(VCCAUX) U1.AA21(VCCAUX) U1.F6(VCCAUX) U1.F21(VCCAUX) U1.G12(VCCAUX) U1.G15(VCCAUX) U1.J9(VCCAUX) U1.J18(VCCAUX) U1.K13(VCCAUX) U1.L5(VCCAUX) U1.L22(VCCAUX) U1.M17(VCCAUX) U1.N10(VCCAUX) U1.U6(VCCAUX) U1.U14(VCCAUX) U1.V9(VCCAUX) U1.Y19(VCCAUX)
GND: C39.1 C40.1 C41.1 C42.1 C43.1 C44.1 C45.1 C46.1 C47.1 C48.1 C49.1 C50.1 C51.1 C52.1 C53.1 C54.1 C55.1 C56.1 C57.1 C58.1 C59.1 C60.1 C61.1 C62.1 C63.1 C64.1 C65.1 C68.1 C69.1 C70.1 C71.1 C72.1 C73.1 C74.1 C75.1 C76.1 C77.1 C78.1 C79.1 C80.1 C81.1 C82.1 C83.1 C84.1 C85.1 C86.1 C87.1 C88.1 C89.1 C90.1 C91.1 C92.1 C93.1 C94.1 C95.1 C96.1 C97.1 U1.A1(GND) U1.A26(GND) U1.AB2(GND) U1.AB12(GND) U1.AB16(GND) U1.AB20(GND) U1.AB25(GND) U1.AC8(GND) U1.AE6(GND) U1.AE10(GND) U1.AE14(GND) U1.AE18(GND) U1.AE22(GND) U1.AF1(GND) U1.AF26(GND) U1.B5(GND) U1.B9(GND) U1.B13(GND) U1.B17(GND) U1.B21(GND) U1.D4(GND) U1.E7(GND) U1.E11(GND) U1.E15(GND) U1.E22(GND) U1.F2(GND) U1.F19(GND) U1.F25(GND) U1.H4(GND) U1.H11(GND) U1.H23(GND) U1.J8(GND) U1.J19(GND) U1.K2(GND) U1.K16(GND) U1.K25(GND) U1.L11(GND) U1.L13(GND) U1.L15(GND) U1.M5(GND) U1.M12(GND) U1.M14(GND) U1.M16(GND) U1.M22(GND) U1.N11(GND) U1.N13(GND) U1.N15(GND) U1.P2(GND) U1.P12(GND) U1.P14(GND) U1.P16(GND) U1.P19(GND) U1.P25(GND) U1.R8(GND) U1.R11(GND) U1.R13(GND) U1.R15(GND) U1.T5(GND) U1.T12(GND) U1.T14(GND) U1.T16(GND) U1.T21(GND) U1.U11(GND) U1.V2(GND) U1.V25(GND) U1.W15(GND) U1.W20(GND) U1.Y4(GND) U1.Y7(GND) U1.Y11(GND) U1.Y23(GND)  [project net nCS]

Not connected (* = marked no-connect by the designer): U1 E12(NC)* F8(NC)* F12(NC)* F14(NC)* G9(NC)* G11(NC)* G13(NC)* H9(NC)* H10(NC)* H12(NC)* H13(NC)* J11(NC)* J12(NC)* J13(NC)* J16(NC)* K12(NC)* K14(NC)* K15(NC)*

### Notes on the sheet
- UG394 - Reducing VCCAUX to 2.5V can reduce the power consumption on the VCCAUX rail by 40%.
  BUT
  The differential termination resistor (DIFF_TERM) can be more tightly controlled around 100Ω when VCCAUX is 3.3V.
- UG393 p.15 - recommended cap
  100uF Ceramic cap have been replaced by 2 47uF for less DC bias
- (near C50) x4
- (near C53) x3
- (near C59) x6
- x2
- (near C46) x4
- (near C65) x3
- (near C73) x3
- (near C79) x3
- (near C85) x3
- (near C91) x3
- (near C97) x3
- Sheet Name
- Project Title
- Global Project
- Size
- Group
- Revision
- Date
- Sheet
- of
- Filename
- Designers

### Library data of the parts
C39 C47-C49 C60 C68 C74 C80 C86 C92 = CAP - 1210: Precision: 10%; Voltage: 16V; Value: 47uF; Current: *; CreatedBy: Jonathan Bouchard; Power: *; Package: 1210; Supplier 1: Arrow Electronics; Supplier Part Number 1: CL32A476KOJNNNE
C40 C50 C61 C69 C75 C81 C87 C93 = CAP - 1210: Precision: 10%; Current: *; CreatedBy: Jonathan Bouchard; Power: *; Supplier 1: Arrow Electronics; Supplier Part Number 1: CL32A476KOJNNNE
C41 C51 C52 = CAP - 0805: Precision: 10%; Voltage: 16V; Value: 4.7uF; Current: *; CreatedBy: Jonathan Bouchard; Power: *; Package: 0805; Supplier 1: Arrow Electronics; Supplier Part Number 1: CL21B475KOFNFNE
C42 C53 C62 C70 C76 C82 C88 C94 = CAP - 0805: Precision: 10%; Current: *; CreatedBy: Jonathan Bouchard; Power: *; Supplier 1: Arrow Electronics; Supplier Part Number 1: CL21B475KOFNFNE
C43-C45 C54-C58 C63 C64 C71 C72 C77 C78 C83 C84 C89 C90 C95 C96 = CAP - 0603: Precision: 10%; Voltage: 16V; Value: 0.47uF; Current: *; CreatedBy: Jonathan Bouchard; Power: *; Package: 0603; Supplier 1: Arrow Electronics; Supplier Part Number 1: C1608X7R1C474K080AC
C46 C59 C65 C73 C79 C85 C91 C97 = CAP - 0603: Precision: 10%; Current: *; CreatedBy: Jonathan Bouchard; Power: *; Supplier 1: Arrow Electronics; Supplier Part Number 1: C1608X7R1C474K080AC
U1 = FPGA_XC6SLX100-3FGG676C: as U1 on sheet S7CAS-PLEIADES-CARTE-MERE_Pxx_FPGA_bank0_1_5; Current: *; Power: *; Mfg: Xilinx; Mfg Part Number: XC6SLX100-3FGG676C; HelpURL: https://www.xilinx.com/support/documentation/data_sheets/ds162.pdf; CreatedBy: Jonathan Bouchard; Temperature: 0°C ~ 85°C (TJ); Value: *; Precision: *; Package: BGA-676; Supplier 1: Digikey; Supplier Part Number 1: 122-1760-ND